# EAGLE design Modulator and Front End (EAGLE 6.3)

## Sheet 1 of 4
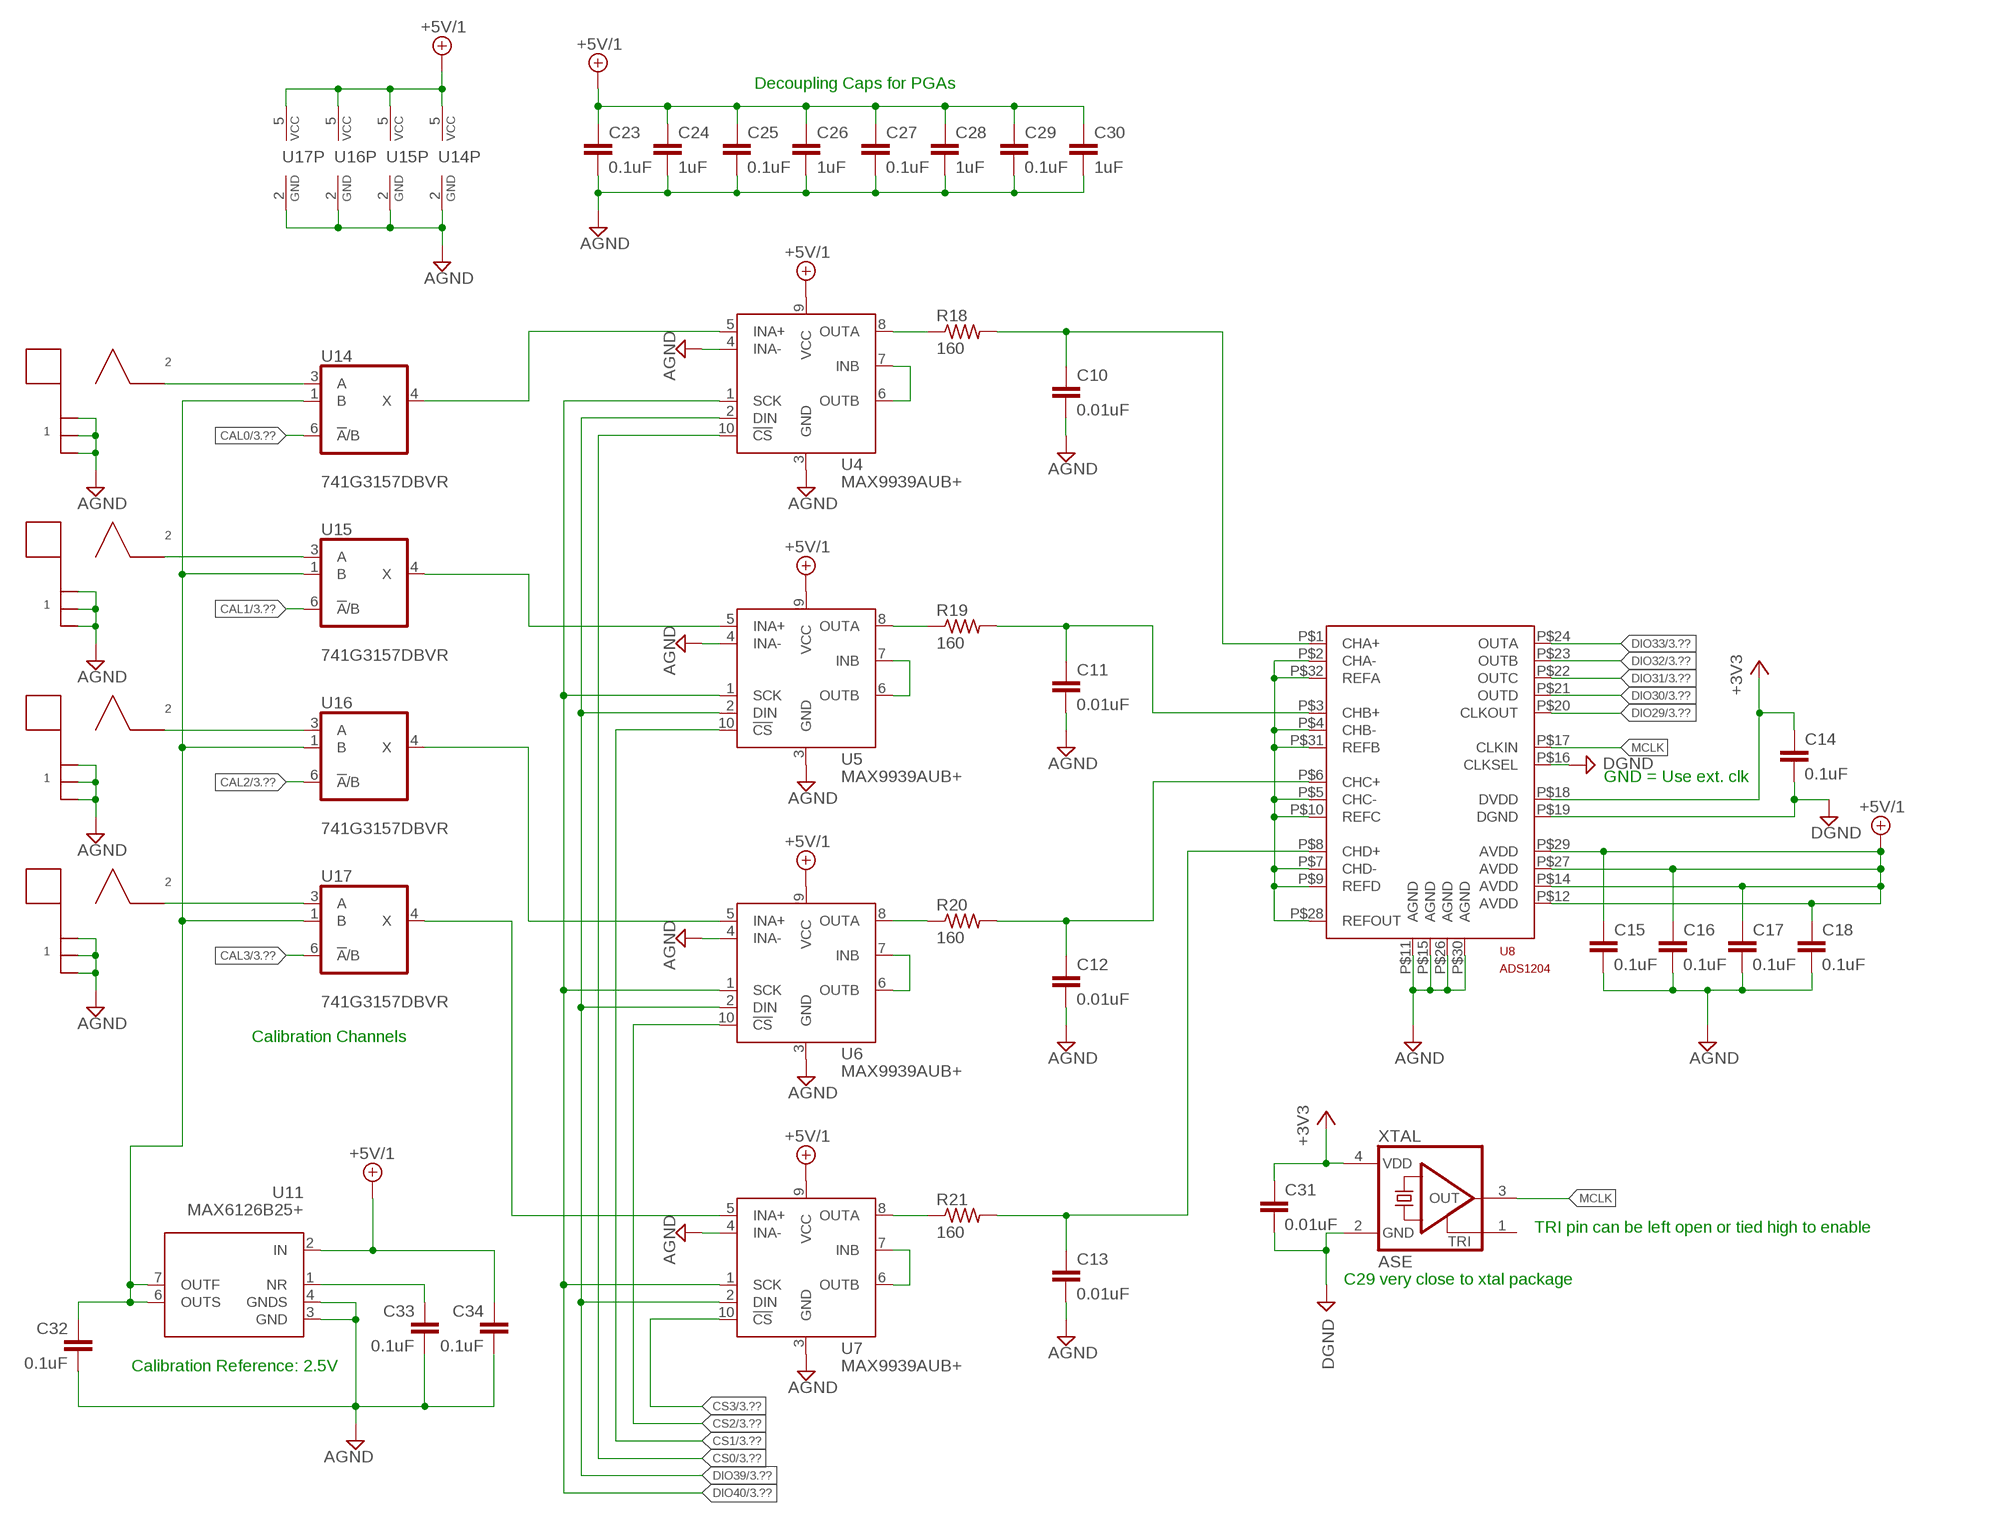
[diagram p0: schematic, sheet 1]

### Parts
C10  0.01uF  C-EUC0805  [C0805]
C11  0.01uF  C-EUC0805  [C0805]
C12  0.01uF  C-EUC0805  [C0805]
C13  0.01uF  C-EUC0805  [C0805]
C14  0.1uF  C-EUC0805  [C0805]
C15  0.1uF  C-EUC0805  [C0805]
C16  0.1uF  C-EUC0805  [C0805]
C17  0.1uF  C-EUC0805  [C0805]
C18  0.1uF  C-EUC0805  [C0805]
C23  0.1uF  C-EUC0805  [C0805]
C24  1uF  C-EUC0805  [C0805]
C25  0.1uF  C-EUC0805  [C0805]
C26  1uF  C-EUC0805  [C0805]
C27  0.1uF  C-EUC0805  [C0805]
C28  1uF  C-EUC0805  [C0805]
C29  0.1uF  C-EUC0805  [C0805]
C30  1uF  C-EUC0805  [C0805]
C31  0.01uF  C-EUC0805  [C0805]
C32  0.1uF  C-EUC0805  [C0805]
C33  0.1uF  C-EUC0805  [C0805]
C34  0.1uF  C-EUC0805  [C0805]
INA  RCJ-01X  [RCJ-01X]
INB  RCJ-01X  [RCJ-01X]
INC  RCJ-01X  [RCJ-01X]
IND  RCJ-01X  [RCJ-01X]
R18  160  R-US_M0805  [M0805]
R19  160  R-US_M0805  [M0805]
R20  160  R-US_M0805  [M0805]
R21  160  R-US_M0805  [M0805]
U4  MAX9939AUB+  [UMAX10]
U5  MAX9939AUB+  [UMAX10]
U6  MAX9939AUB+  [UMAX10]
U7  MAX9939AUB+  [UMAX10]
U8  ADS1204  [QFN-32]
U11  MAX6126B25+  [UMAX8]
U14  741G3157DBVR  [DBV_R-PDSO-G6]
U15  741G3157DBVR  [DBV_R-PDSO-G6]
U16  741G3157DBVR  [DBV_R-PDSO-G6]
U17  741G3157DBVR  [DBV_R-PDSO-G6]
XTAL  ASE  [ASE]

### Nets
+3V3: C14.1 C31.1 U8.P$18(DVDD) XTAL.4(VDD) ; also sheet 2,3
+5V/1: C15.1 C16.1 C17.1 C18.1 C23.1 C24.1 C25.1 C26.1 C27.1 C28.1 C29.1 C30.1 C34.1 U4.9(VCC) U5.9(VCC) U6.9(VCC) U7.9(VCC) U8.P$12(AVDD) U8.P$14(AVDD) U8.P$27(AVDD) U8.P$29(AVDD) U11.2(IN) U14.5(VCC) U15.5(VCC) U16.5(VCC) U17.5(VCC) ; also sheet 2,4
AGND: C10.2 C11.2 C12.2 C13.2 C15.2 C16.2 C17.2 C18.2 C23.2 C24.2 C25.2 C26.2 C27.2 C28.2 C29.2 C30.2 C32.2 C33.2 C34.2 INA.1@1 INA.1@2 INA.1@3 INB.1@1 INB.1@2 INB.1@3 INC.1@1 INC.1@2 INC.1@3 IND.1@1 IND.1@2 IND.1@3 U4.3(GND) U4.4(INA-) U5.3(GND) U5.4(INA-) U6.3(GND) U6.4(INA-) U7.3(GND) U7.4(INA-) U8.P$11(AGND) U8.P$15(AGND) U8.P$26(AGND) U8.P$30(AGND) U11.3(GND) U11.4(GNDS) U14.2(GND) U15.2(GND) U16.2(GND) U17.2(GND) ; also sheet 2,4
CAL0: U14.6(!A!/B) ; also sheet 3
CAL1: U15.6(!A!/B) ; also sheet 3
CAL2: U16.6(!A!/B) ; also sheet 3
CAL3: U17.6(!A!/B) ; also sheet 3
CS0: U4.10(!CS) ; also sheet 3
CS1: U5.10(!CS) ; also sheet 3
CS2: U6.10(!CS) ; also sheet 3
CS3: U7.10(!CS) ; also sheet 3
DGND: C14.2 C31.2 U8.P$16(CLKSEL) U8.P$19(DGND) XTAL.2(GND) ; also sheet 2,3
DIO29: U8.P$20(CLKOUT) ; also sheet 3
DIO30: U8.P$21(OUTD) ; also sheet 3
DIO31: U8.P$22(OUTC) ; also sheet 3
DIO32: U8.P$23(OUTB) ; also sheet 3
DIO33: U8.P$24(OUTA) ; also sheet 3
DIO39: U4.2(DIN) U5.2(DIN) U6.2(DIN) U7.2(DIN) ; also sheet 3
DIO40: U4.1(SCK) U5.1(SCK) U6.1(SCK) U7.1(SCK) ; also sheet 3
MCLK: U8.P$17(CLKIN) XTAL.3(OUT)
N$1: R21.1 U7.8(OUTA)
N$3: R20.1 U6.8(OUTA)
N$4: C10.1 R18.2 U8.P$1(CHA+)
N$6: R19.1 U5.8(OUTA)
N$10: R18.1 U4.8(OUTA)
N$12: C33.1 U11.1(NR)
N$14: C11.1 R19.2 U8.P$3(CHB+)
N$15: U4.5(INA+) U14.4(X)
N$17: U5.5(INA+) U15.4(X)
N$18: U6.5(INA+) U16.4(X)
N$19: INA.2 U14.3(A)
N$20: C12.1 R20.2 U8.P$6(CHC+)
N$21: C13.1 R21.2 U8.P$8(CHD+)
N$22: INB.2 U15.3(A)
N$23: INC.2 U16.3(A)
N$24: IND.2 U17.3(A)
N$25: U7.5(INA+) U17.4(X)
N$27: C32.1 U11.6(OUTS) U11.7(OUTF) U14.1(B) U15.1(B) U16.1(B) U17.1(B)
N$50: U4.6(OUTB) U4.7(INB)
N$51: U5.6(OUTB) U5.7(INB)
N$52: U6.6(OUTB) U6.7(INB)
N$53: U7.6(OUTB) U7.7(INB)
VREF: U8.P$2(CHA-) U8.P$4(CHB-) U8.P$5(CHC-) U8.P$7(CHD-) U8.P$9(REFD) U8.P$10(REFC) U8.P$28(REFOUT) U8.P$31(REFB) U8.P$32(REFA)
Unconnected: XTAL.1(TRI)

### Notes on the sheet
- Decoupling Caps for PGAs
- GND = Use ext. clk
- Calibration Channels
- TRI pin can be left open or tied high to enable
- C29 very close to xtal package
- Calibration Reference: 2.5V

## Sheet 2 of 4
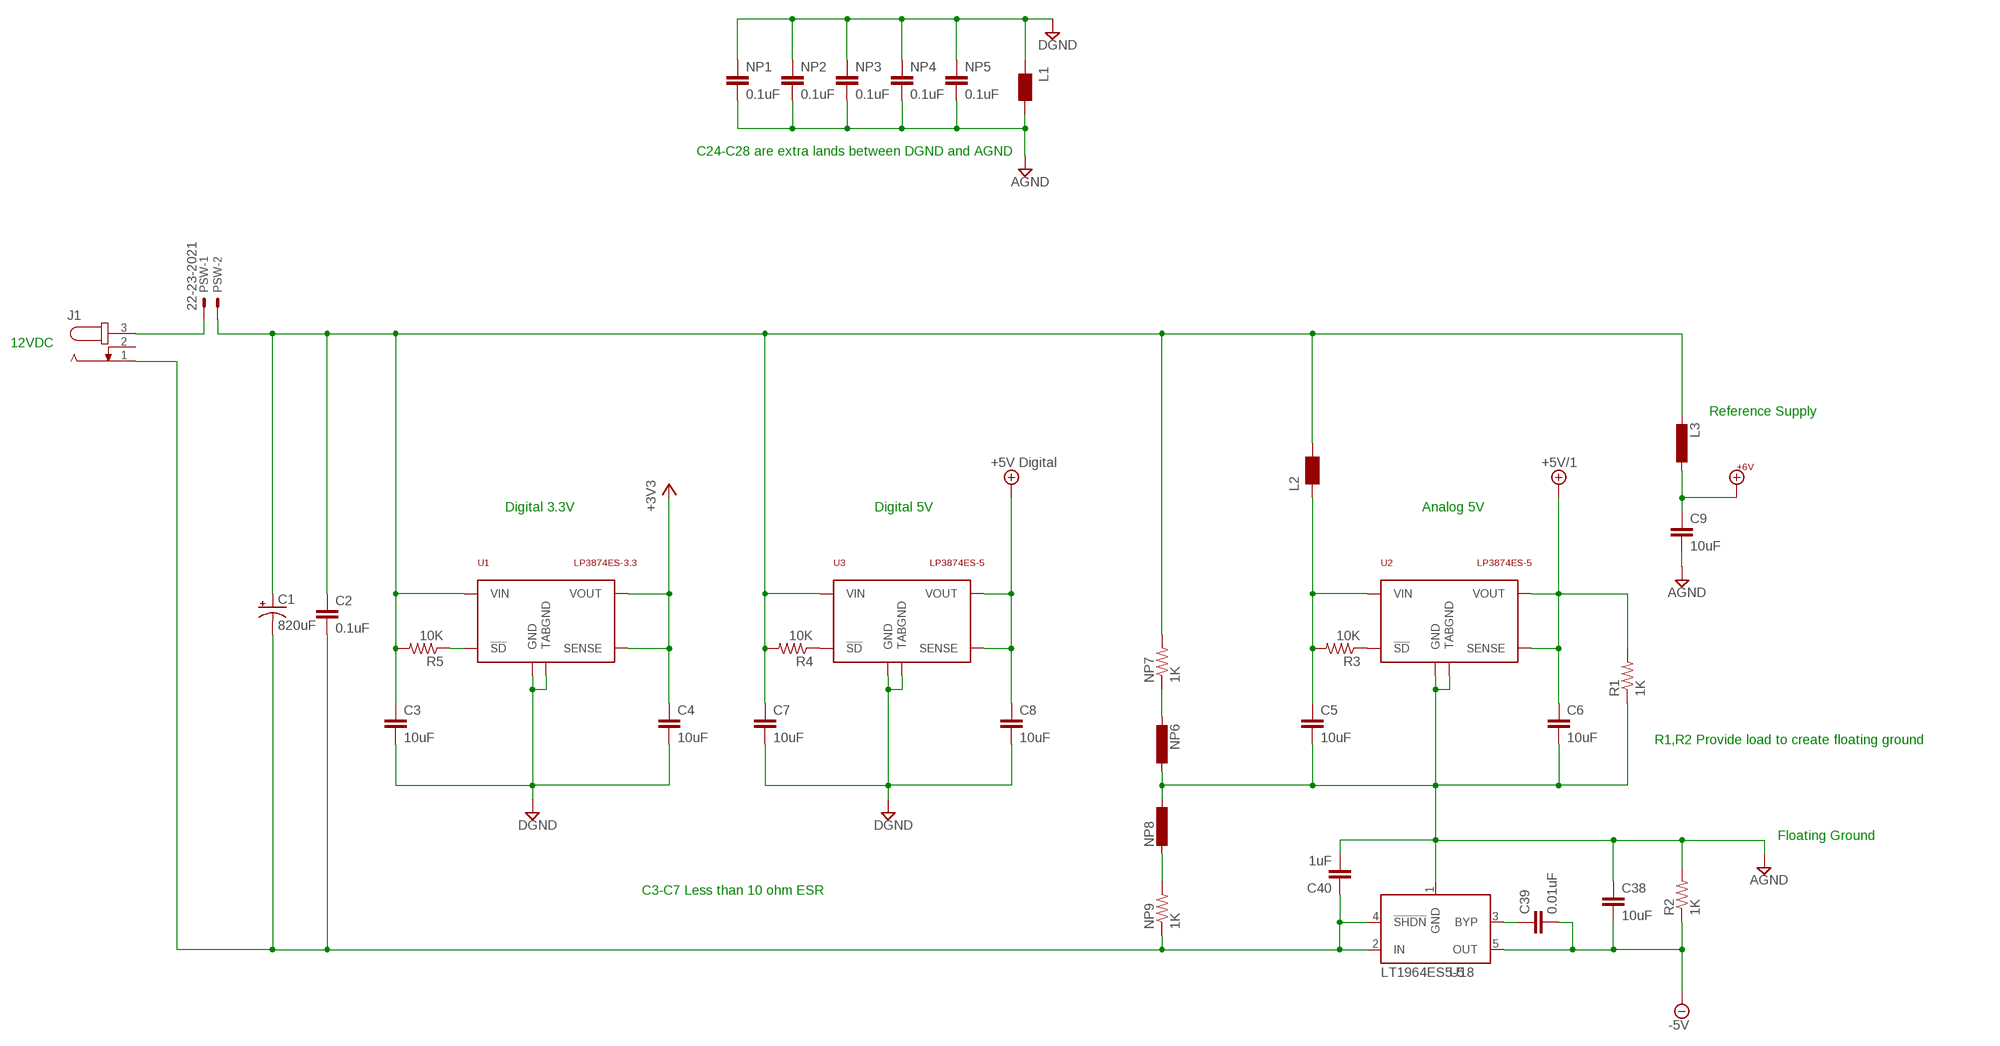
[diagram p1: schematic, sheet 2]

### Parts
C1  820uF  CPOL-USE5-13  [E5-13]
C2  0.1uF  C-EUC0805  [C0805]
C3  10uF  C-EUC1206  [C1206]
C4  10uF  C-EUC1206  [C1206]
C5  10uF  C-EUC1206  [C1206]
C6  10uF  C-EUC1206  [C1206]
C7  10uF  C-EUC1206  [C1206]
C8  10uF  C-EUC1206  [C1206]
C9  10uF  C-EUC1206  [C1206]
C38  10uF  C-EUC1206  [C1206]
C39  0.01uF  C-EUC1206  [C1206]
C40  1uF  C-EUC1206  [C1206]
J1  JACK-PLUG1  [SPC4078]
L1  WE-CBF_0603  [0603]
L2  WE-CBF_0603  [0603]
L3  L-EUL1812  [L1812]
NP1  0.1uF  C-EUC0805  [C0805]
NP2  0.1uF  C-EUC0805  [C0805]
NP3  0.1uF  C-EUC0805  [C0805]
NP4  0.1uF  C-EUC0805  [C0805]
NP5  0.1uF  C-EUC0805  [C0805]
NP6  L-EUL1812  [L1812]
NP7  1K  R-US_M0805  [M0805]
NP8  L-EUL1812  [L1812]
NP9  1K  R-US_M0805  [M0805]
PSW  22-23-2021  [22-23-2021]
R1  1K  R-US_M0805  [M0805]
R2  1K  R-US_M0805  [M0805]
R3  10K  R-US_M0805  [M0805]
R4  10K  R-US_M0805  [M0805]
R5  10K  R-US_M0805  [M0805]
U1  LP3874ES-3.3  [TO263-5]
U2  LP3874ES-5  [TO263-5]
U3  LP3874ES-5  [TO263-5]
U18  LT1964ES5-5  [SOT23-5]

### Nets
+3V3: C4.1 U1.4(VOUT) U1.5(SENSE) ; also sheet 1,3
+5V/1: C6.1 R1.2 U2.4(VOUT) U2.5(SENSE) ; also sheet 1,4
+5V/2: C8.1 U3.4(VOUT) U3.5(SENSE) ; supply symbol labelled +5V Digital ; also sheet 3
+6V: C9.1 L3.1 ; also sheet 4
-5V: C38.2 C39.2 R2.1 U18.5(OUT) ; also sheet 4
AGND: C5.2 C6.2 C9.2 C38.1 C40.2 L1.2 NP1.2 NP2.2 NP3.2 NP4.2 NP5.2 NP6.1 NP8.1 R1.1 R2.2 U2.3(GND) U2.6(TABGND) U18.1(GND) ; also sheet 1,4
DGND: C3.2 C4.2 C7.2 C8.2 L1.1 NP1.1 NP2.1 NP3.1 NP4.1 NP5.1 U1.3(GND) U1.6(TABGND) U3.3(GND) U3.6(TABGND) ; also sheet 1,3
N$5: C1.- C2.2 C40.1 J1.1 NP9.1 U18.2(IN) U18.4(!SHDN)
N$7: R3.1 U2.1(!SD)
N$8: C5.1 L2.1 R3.2 U2.2(VIN)
N$9: NP8.2 NP9.2
N$13: C39.1 U18.3(BYP)
N$31: R4.1 U3.1(!SD)
N$48: NP6.2 NP7.1
N$49: J1.3 PSW.1
N$911: R5.1 U1.1(!SD)
PWRIN: C1.+ C2.1 C3.1 C7.1 L2.2 L3.2 NP7.2 PSW.2 R4.2 R5.2 U1.2(VIN) U3.2(VIN)
Unconnected: J1.2

### Notes on the sheet
- C24-C28 are extra lands between DGND and AGND
- 12VDC
- Reference Supply
- Digital 3.3V | Digital 5V | Analog 5V
- R1,R2 Provide load to create floating ground
- Floating Ground
- C3-C7 Less than 10 ohm ESR

## Sheet 3 of 4
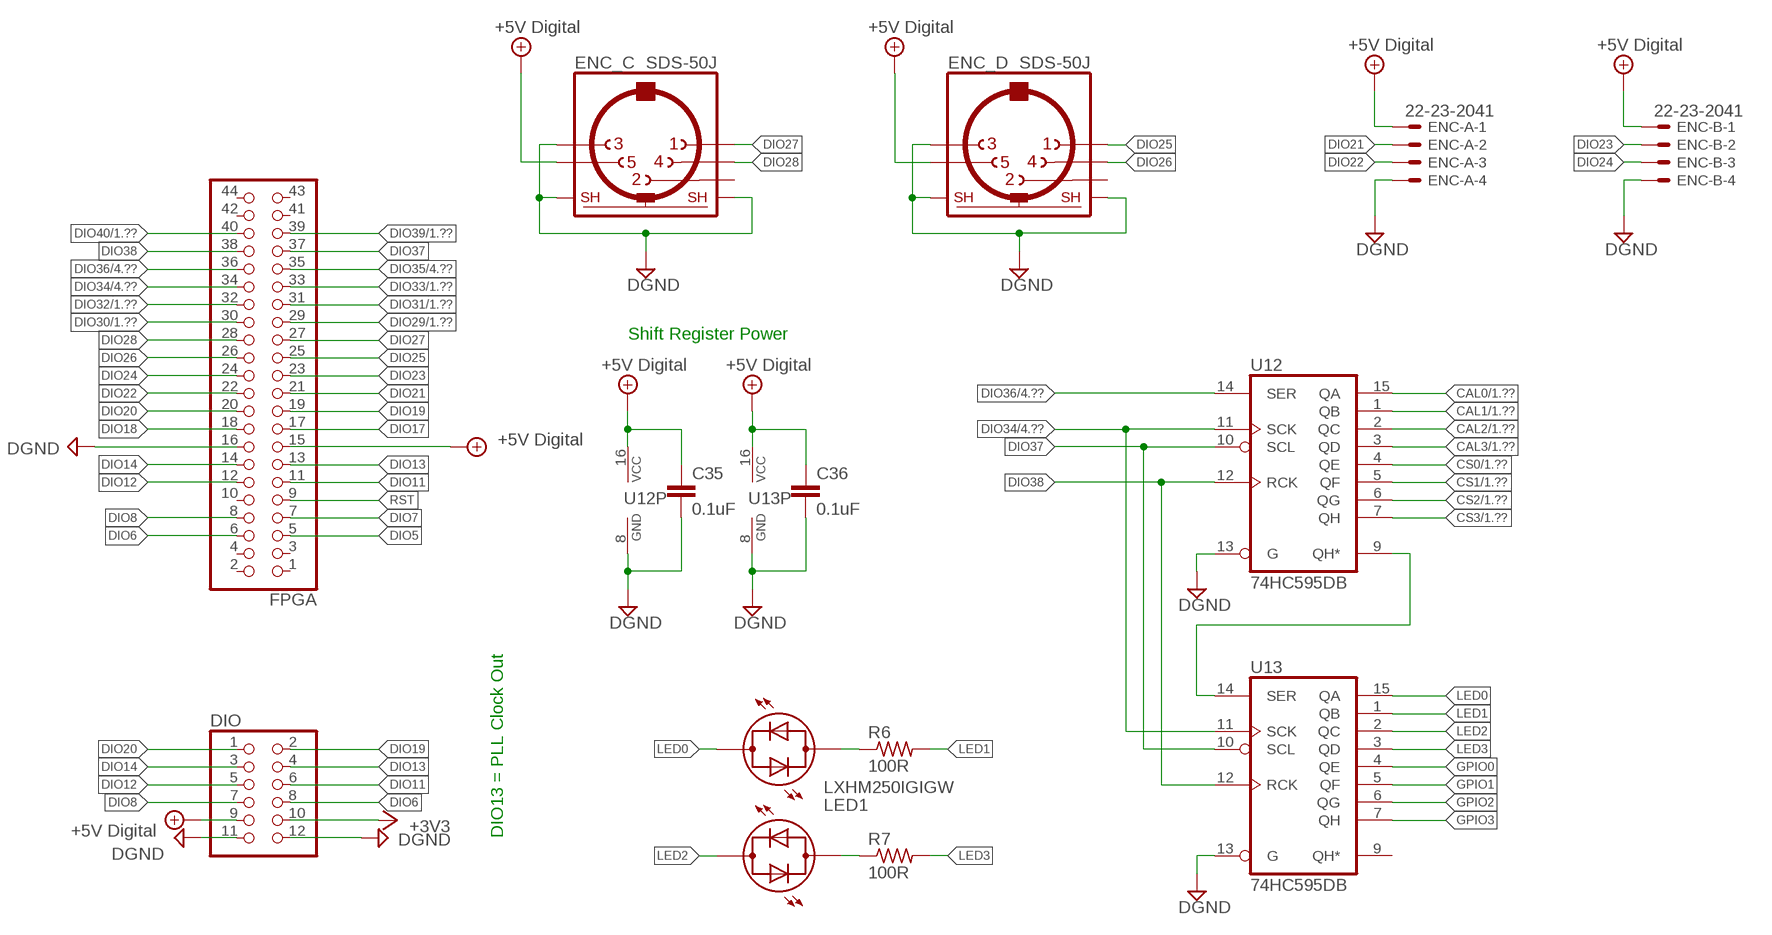
[diagram p2: schematic, sheet 3]

### Parts
C35  0.1uF  C-EUC0805  [C0805]
C36  0.1uF  C-EUC0805  [C0805]
DIO  PINHD-2X6  [2X06]
ENC-A  22-23-2041  [22-23-2041]
ENC-B  22-23-2041  [22-23-2041]
ENC_C  SDS-50J  [SDS-50J]
ENC_D  SDS-50J  [SDS-50J]
FPGA  PINHD-2X22  [2X22]
LED1  LXHM250IGIGW  [LXHM250IGIGW]
R6  100R  R-US_R0805  [R0805]
R7  100R  R-US_R0805  [R0805]
U12  74HC595DB  [SSOP16]
U13  74HC595DB  [SSOP16]

### Nets
+3V3: DIO.10 ; also sheet 1,2
+5V/2: C35.1 C36.1 DIO.9 ENC-A.1 ENC-B.1 ENC_C.5 ENC_D.5 FPGA.15 U12.16(VCC) U13.16(VCC) ; supply symbol labelled +5V Digital ; also sheet 2
CAL0: U12.15(QA) ; also sheet 1
CAL1: U12.1(QB) ; also sheet 1
CAL2: U12.2(QC) ; also sheet 1
CAL3: U12.3(QD) ; also sheet 1
CS0: U12.4(QE) ; also sheet 1
CS1: U12.5(QF) ; also sheet 1
CS2: U12.6(QG) ; also sheet 1
CS3: U12.7(QH) ; also sheet 1
DGND: C35.2 C36.2 DIO.11 DIO.12 ENC-A.4 ENC-B.4 ENC_C.3 ENC_C.SH1 ENC_C.SH2 ENC_D.3 ENC_D.SH1 ENC_D.SH2 FPGA.16 U12.8(GND) U12.13(G) U13.8(GND) U13.13(G) ; also sheet 1,2
DIO5: FPGA.5
DIO6: DIO.8 FPGA.6
DIO7: FPGA.7
DIO8: DIO.7 FPGA.8
DIO11: DIO.6 FPGA.11
DIO12: DIO.5 FPGA.12
DIO13: DIO.4 FPGA.13
DIO14: DIO.3 FPGA.14
DIO17: FPGA.17
DIO18: FPGA.18
DIO19: DIO.2 FPGA.19
DIO20: DIO.1 FPGA.20
DIO21: ENC-A.2 FPGA.21
DIO22: ENC-A.3 FPGA.22
DIO23: ENC-B.2 FPGA.23
DIO24: ENC-B.3 FPGA.24
DIO25: ENC_D.1 FPGA.25
DIO26: ENC_D.4 FPGA.26
DIO27: ENC_C.1 FPGA.27
DIO28: ENC_C.4 FPGA.28
DIO29: FPGA.29 ; also sheet 1
DIO30: FPGA.30 ; also sheet 1
DIO31: FPGA.31 ; also sheet 1
DIO32: FPGA.32 ; also sheet 1
DIO33: FPGA.33 ; also sheet 1
DIO34: FPGA.34 U12.11(SCK) U13.11(SCK) ; also sheet 4
DIO35: FPGA.35 ; also sheet 4
DIO36: FPGA.36 U12.14(SER) ; also sheet 4
DIO37: FPGA.37 U12.10(SCL) U13.10(SCL)
DIO38: FPGA.38 U12.12(RCK) U13.12(RCK)
DIO39: FPGA.39 ; also sheet 1
DIO40: FPGA.40 ; also sheet 1
GPIO0: U13.4(QE)
GPIO1: U13.5(QF)
GPIO2: U13.6(QG)
GPIO3: U13.7(QH)
LED0: LED1.AR1 U13.15(QA)
LED1: R6.2 U13.1(QB)
LED2: LED1.AR2 U13.2(QC)
LED3: R7.2 U13.3(QD)
N$2: U12.9(QH*) U13.14(SER)
N$28: LED1.AG1 R6.1
N$38: LED1.AG2 R7.1
RST: FPGA.9
Unconnected: ENC_C.2 ENC_D.2 FPGA.1 FPGA.2 FPGA.3 FPGA.4 FPGA.10 FPGA.41 FPGA.42 FPGA.43 FPGA.44 U13.9(QH*)

### Notes on the sheet
- Shift Register Power
- DIO13 = PLL Clock Out

## Sheet 4 of 4
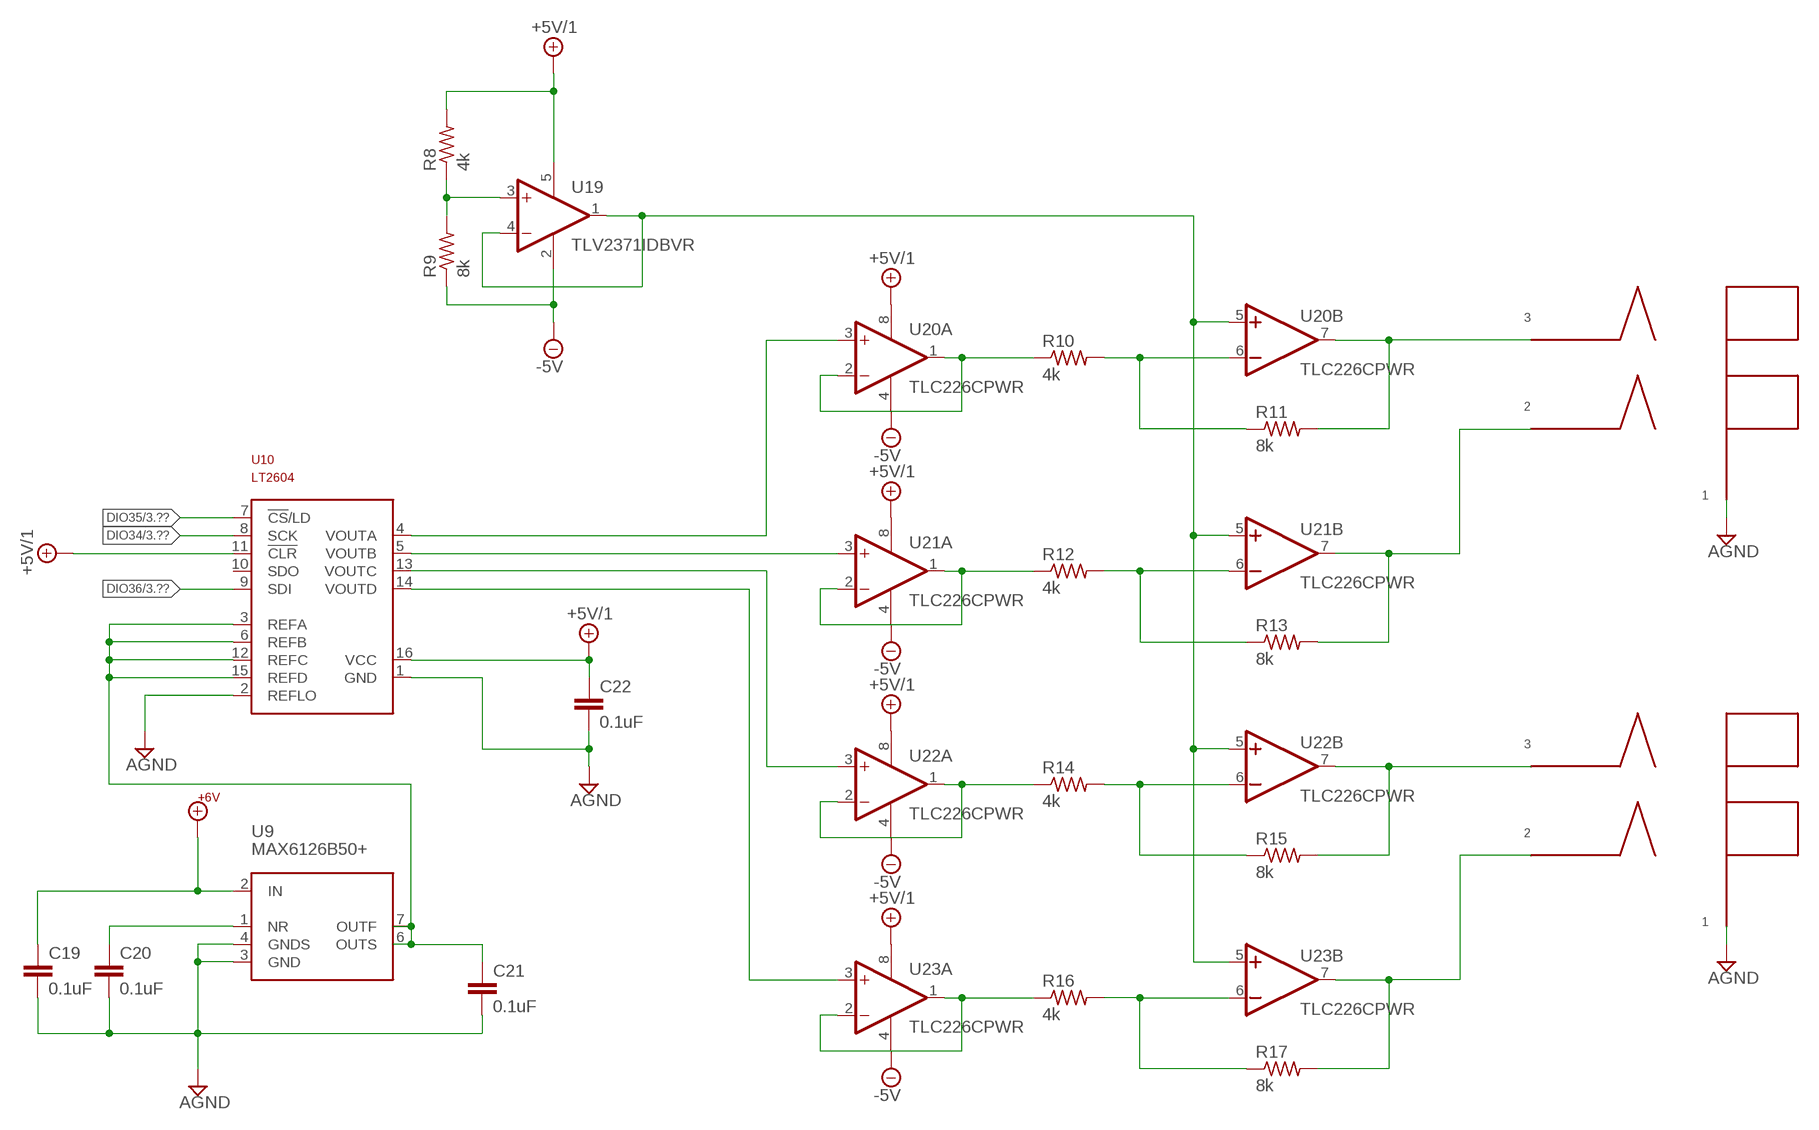
[diagram p3: schematic, sheet 4]

### Parts
C19  0.1uF  C-EUC0805  [C0805]
C20  0.1uF  C-EUC0805  [C0805]
C21  0.1uF  C-EUC0805  [C0805]
C22  0.1uF  C-EUC0805  [C0805]
OUTAB  RCJ-22XX  [RCJ-22XX]
OUTCD  RCJ-22XX  [RCJ-22XX]
R8  4k  R-US_R0805  [R0805]
R9  8k  R-US_R0805  [R0805]
R10  4k  R-US_R0805  [R0805]
R11  8k  R-US_R0805  [R0805]
R12  4k  R-US_R0805  [R0805]
R13  8k  R-US_R0805  [R0805]
R14  4k  R-US_R0805  [R0805]
R15  8k  R-US_R0805  [R0805]
R16  4k  R-US_R0805  [R0805]
R17  8k  R-US_R0805  [R0805]
U9  MAX6126B50+  [UMAX8]
U10  LT2604  [SSOP16]
U19  TLV2371IDBVR  [SOT23-DBV]
U20  TLC226CPWR  [TSSOP8]
U21  TLC226CPWR  [TSSOP8]
U22  TLC226CPWR  [TSSOP8]
U23  TLC226CPWR  [TSSOP8]

### Nets
+5V/1: C22.1 R8.2 U10.11(!CLR) U10.16(VCC) U19.5(V+) U20.8(A:V+) U21.8(A:V+) U22.8(A:V+) U23.8(A:V+) ; also sheet 1,2
+6V: C19.1 U9.2(IN) ; also sheet 2
-5V: R9.1 U19.2(V-) U20.4(A:V-) U21.4(A:V-) U22.4(A:V-) U23.4(A:V-) ; also sheet 2
AGND: C19.2 C20.2 C21.2 C22.2 OUTAB.1 OUTCD.1 U9.3(GND) U9.4(GNDS) U10.1(GND) U10.2(REFLO) ; also sheet 1,2
DIO34: U10.8(SCK) ; also sheet 3
DIO35: U10.7(!CS!/LD) ; also sheet 3
DIO36: U10.9(SDI) ; also sheet 3
N$11: R8.1 R9.2 U19.3(+IN)
N$16: U19.1(OUT) U19.4(-IN) U20.5(B:+IN) U21.5(B:+IN) U22.5(B:+IN) U23.5(B:+IN)
N$26: C20.1 U9.1(NR)
N$29: R10.1 U20.1(A:OUT) U20.2(A:-IN)
N$30: C21.1 U9.6(OUTS) U9.7(OUTF) U10.3(REFA) U10.6(REFB) U10.12(REFC) U10.15(REFD)
N$32: U10.4(VOUTA) U20.3(A:+IN)
N$33: U10.5(VOUTB) U21.3(A:+IN)
N$34: U10.13(VOUTC) U22.3(A:+IN)
N$35: U10.14(VOUTD) U23.3(A:+IN)
N$36: R10.2 R11.1 U20.6(B:-IN)
N$37: OUTAB.3 R11.2 U20.7(B:OUT)
N$39: OUTAB.2 R13.2 U21.7(B:OUT)
N$40: R12.2 R13.1 U21.6(B:-IN)
N$41: R14.2 R15.1 U22.6(B:-IN)
N$42: OUTCD.3 R15.2 U22.7(B:OUT)
N$43: OUTCD.2 R17.2 U23.7(B:OUT)
N$44: R16.2 R17.1 U23.6(B:-IN)
N$45: R12.1 U21.1(A:OUT) U21.2(A:-IN)
N$46: R14.1 U22.1(A:OUT) U22.2(A:-IN)
N$47: R16.1 U23.1(A:OUT) U23.2(A:-IN)
Unconnected: U10.10(SDO)

## Library data of the parts
C1 = rcl:CPOL-US: POLARIZED CAPACITOR, American symbol; PARTNO: EEU-TP1E821
C2 C14-C23 C25 C27 C29 C32-C36 = rcl:C-EU: CAPACITOR, European symbol; PARTNO: LMK212SD104KG-T
C3-C9 C38 = rcl:C-EU: CAPACITOR, European symbol; PARTNO: F951C106MPAAQ2
C10-C13 C31 C39 = rcl:C-EU: CAPACITOR, European symbol; PARTNO: 0805YA103JAT2A
C24 C26 C28 C30 C40 = rcl:C-EU: CAPACITOR, European symbol; PARTNO: C2012X7R1A105K
DIO = pinhead:PINHD-2X6: PIN HEADER; PARTNO: 68602-112HLF
ENC-A ENC-B = con-molex:22-23-2041: .100" (2.54mm) Center Header - 4 Pin; MF: MOLEX; MPN: 22-23-2041; OC_FARNELL: 1462920; OC_NEWARK: 38C0355; PARTNO: 22-23-2041
ENC_C ENC_D = con-cui:SDS-50J; PARTNO: SDS-50J
FPGA = pinhead:PINHD-2X22: PIN HEADER; PARTNO: *
INA = con-cui:RCJ-01X; PARTNO: RCJ-012
INB = con-cui:RCJ-01X; PARTNO: RCJ-011
INC = con-cui:RCJ-01X; PARTNO: RCJ-013
IND = con-cui:RCJ-01X; PARTNO: RCJ-014
J1 = con-jack:JACK-PLUG: DC POWER JACK Power Jack, DC, Right Angle, Through Hole, Rated 5A at 16VDC, PC Terminals Distributor: Farnell (www.Farnell.de) Drawing: 84N1161.pdf / 84N1162.pdf Manufacturer: SPC Technology (www.spctechnology.com) Type: SPC4077 / SPC 4078; OC_FARNELL: unknown; OC_NEWARK: unknown; PARTNO: PJ-102B
L1 L2 = wuerth-elektronik:WE-CBF: SMD EMI Suppression Ferrite Beads - excellent anti-EMI properties - low DCR - impedances till 3000 ohms - rated current up to 6 A; PARTNO: MPZ1608S101A
L3 = rcl:L-EU: INDUCTOR, European symbol; PARTNO: NLC453232T-100K-PF
LED1 = led:LXHM250IGIGW; PARTNO: SSF-LXHM250IGIGW
NP1-NP5 = rcl:C-EU: CAPACITOR, European symbol; PARTNO: *
NP6 NP8 = rcl:L-EU: INDUCTOR, European symbol; PARTNO: *
NP7 NP9 = rcl:R-US_: RESISTOR, American symbol; PARTNO: *
OUTAB = con-cui:RCJ-22XX; PARTNO: RCJ-2221
OUTCD = con-cui:RCJ-22XX; PARTNO: RCJ-2234
PSW = con-molex:22-23-2021: .100" (2.54mm) Center Header - 2 Pin; MF: MOLEX; MPN: 22-23-2021; OC_FARNELL: 1462926; OC_NEWARK: 25C3832; PARTNO: 22-23-2021
R1 R2 = rcl:R-US_: RESISTOR, American symbol; PARTNO: ERJ-6GEYJ102V
R3-R5 = rcl:R-US_: RESISTOR, American symbol; PARTNO: ERJ-6GEYJ103V
R6 R7 = rcl:R-US_: RESISTOR, American symbol; PARTNO: ERJ-6GEYJ101V
R8 R10 R12 R14 R16 = rcl:R-US_: RESISTOR, American symbol; PARTNO: ERJ-6ENF5101V
R9 R11 R13 R15 R17 = rcl:R-US_: RESISTOR, American symbol; PARTNO: ERJ-6ENF1022V
R18-R21 = rcl:R-US_: RESISTOR, American symbol; PARTNO: ERJ-6ENF1600V
U1 = national-semiconductor:LP3874; PARTNO: LP3872ES-3.3/NOPB
U2 U3 = national-semiconductor:LP3874; PARTNO: LP3872ES-5.0/NOPB
U4-U7 = maxim:MAX9939: SPI Programmable-Gain Amplifier with Input Vos Trim and Output Op Amp The MAX9939 is a SPI programmable single PGA amplifier. Gains range from 0.25V/V to 157V/V and it contains an input offset trimming register and offset test capability. It also includes a separate op amp with accessible inverting input and output for an external filter or for adding differential output. The non-inverting input of the secondary op amp is tied to Vcc/2.; PARTNO: MAX9939AUB+
U8 = texas:ADS1204: Four 1-Bit, 10MHz, 2nd-Order DELTA-SIGMA MODULATORS Source: http://focus.ti.com/docs/prod/folders/print/ads1204.html; PARTNO: ADS1204IRHBT
U9 = maxim:MAX6126: Ultra-High-Precision, Ultra-Low-Noise, Series Voltage Reference; PARTNO: MAX6126B50+
U10 = linear-technology:LT2604; PARTNO: LTC2604CGN#PBF
U11 = maxim:MAX6126: Ultra-High-Precision, Ultra-Low-Noise, Series Voltage Reference; PARTNO: MAX6126B25+
U12 U13 = 74xx-eu:74*595: 8-bit SHIFT REGISTER, output latch; PARTNO: "74HC595DB,112"
U14-U17 = 74xx-little-us:74*1G3157: Single-Pole, Double-Throw Analog Switch Source: http://focus.ti.com/lit/ds/symlink/sn74lvc1g3157.pdf; PARTNO: "74LVC1G3157GW,125"
U18 = linear-technology:LT1964; PARTNO: LT1964ES5-5#TRMPBF
U19 = texas:TLV237*; PARTNO: TLV2371IDBVR
U20-U23 = texas:TLC226*; PARTNO: TLC2262CPWR
XTAL = crystal:ASE: 3.3Vdc CMOS SMD CRYSTAL CLOCK OSCILLATOR SOurce: www.abracon.com; OC_FARNELL: unknown; OC_NEWARK: unknown; PARTNO: CB3LV-3C-20M4800

## Board
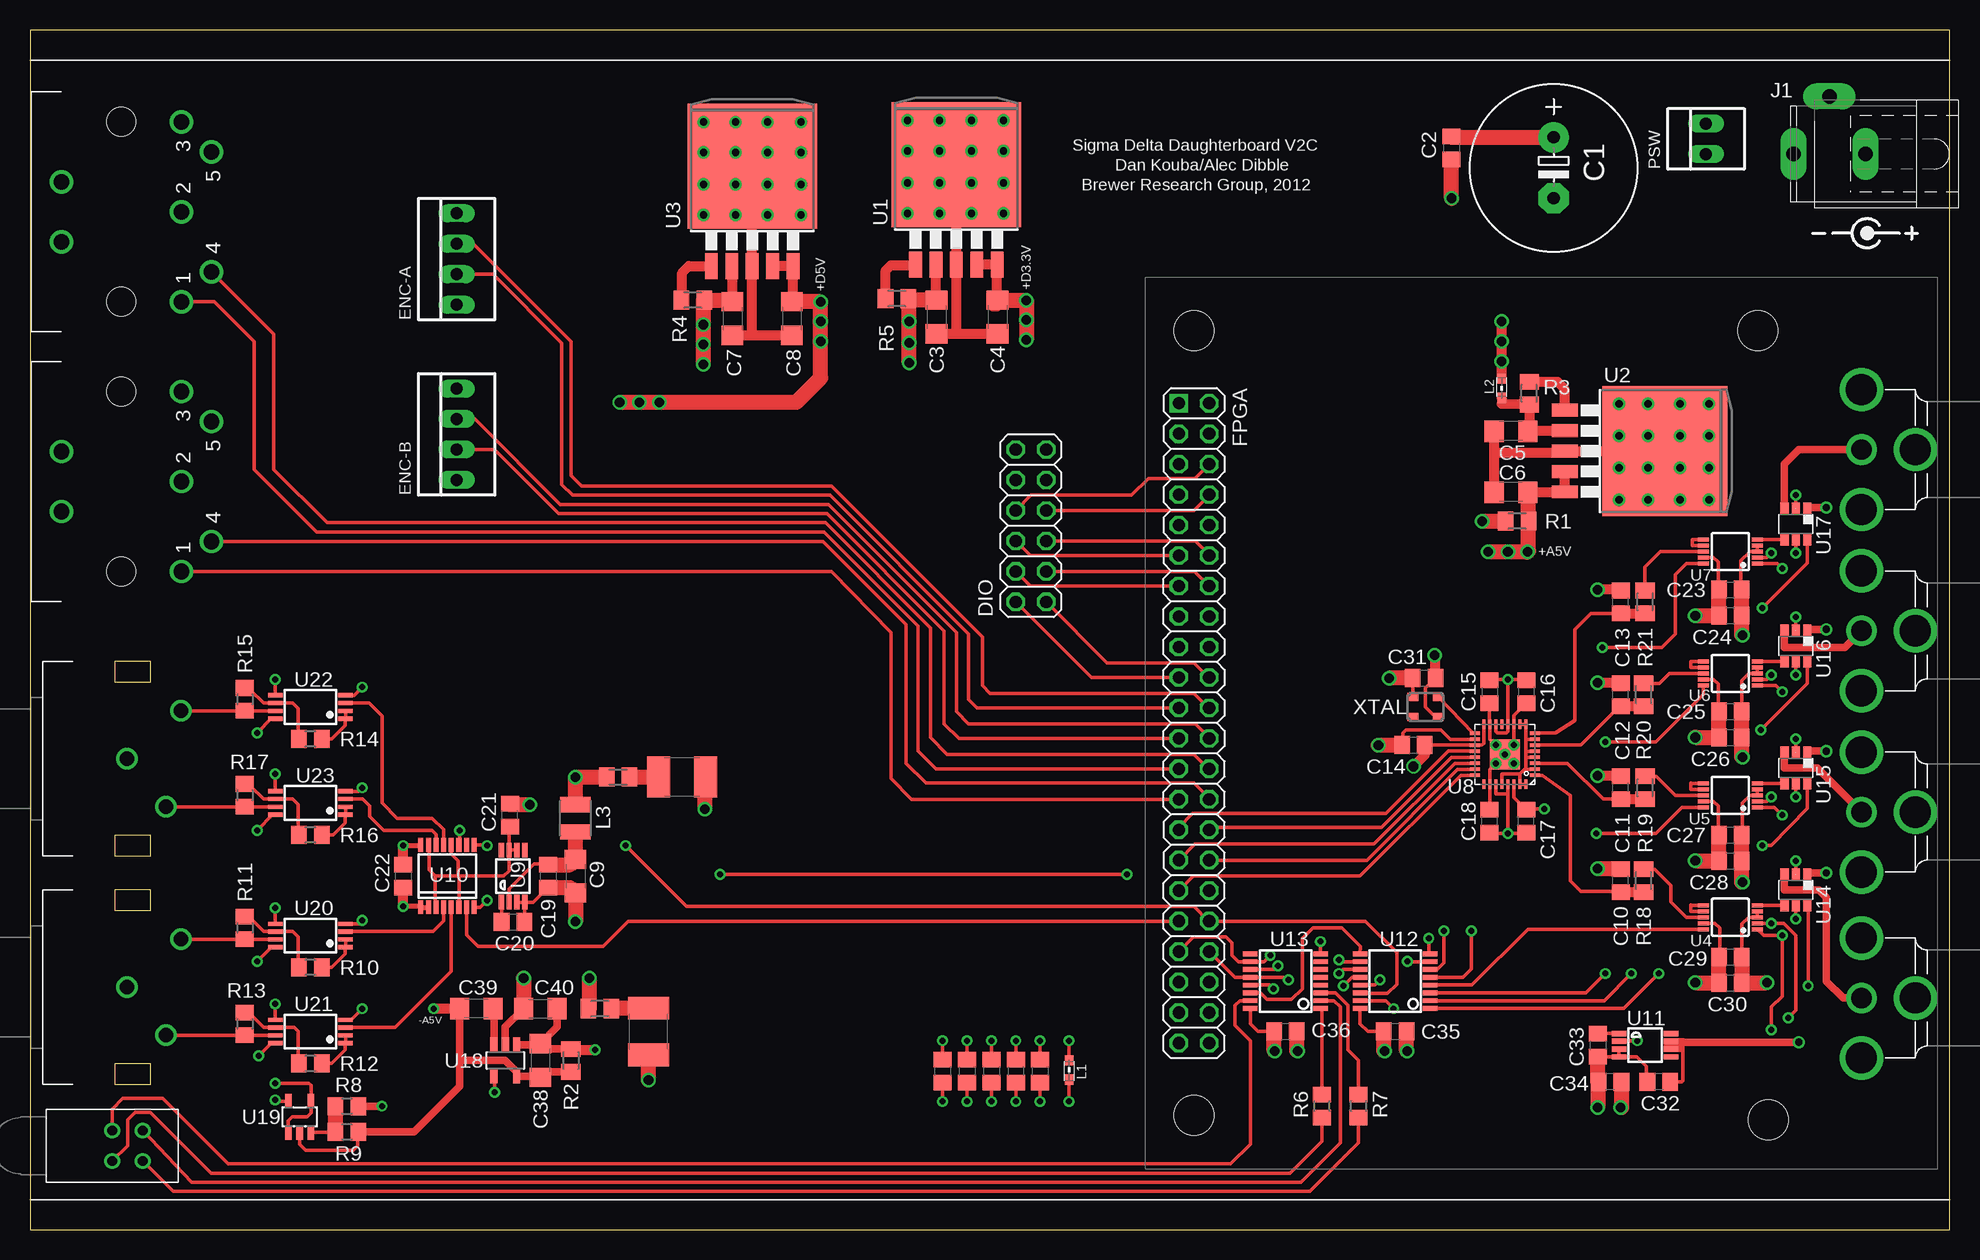
[diagram p4: board, top side]
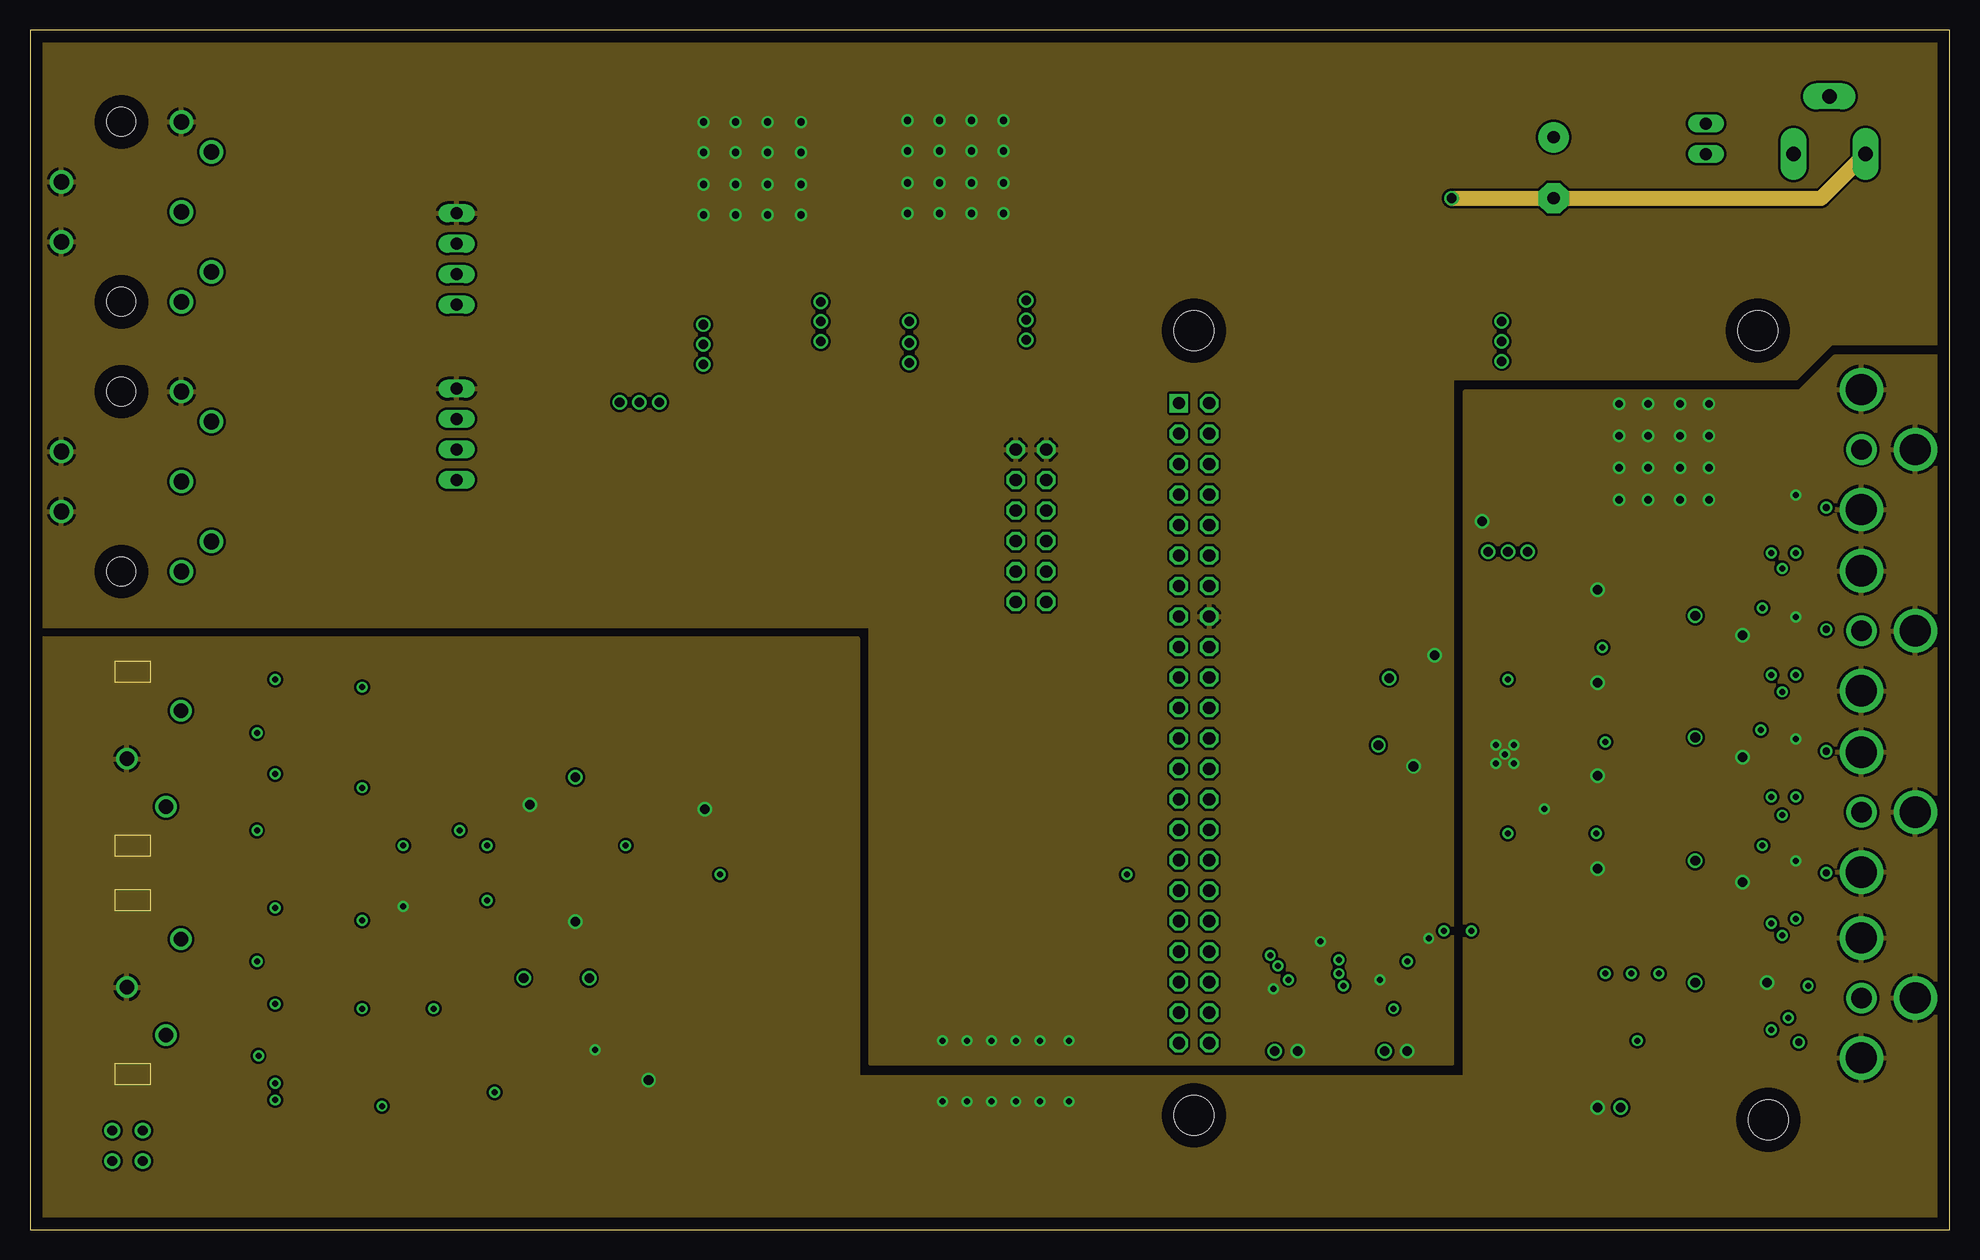
[diagram p5: board, inner layer Route2]
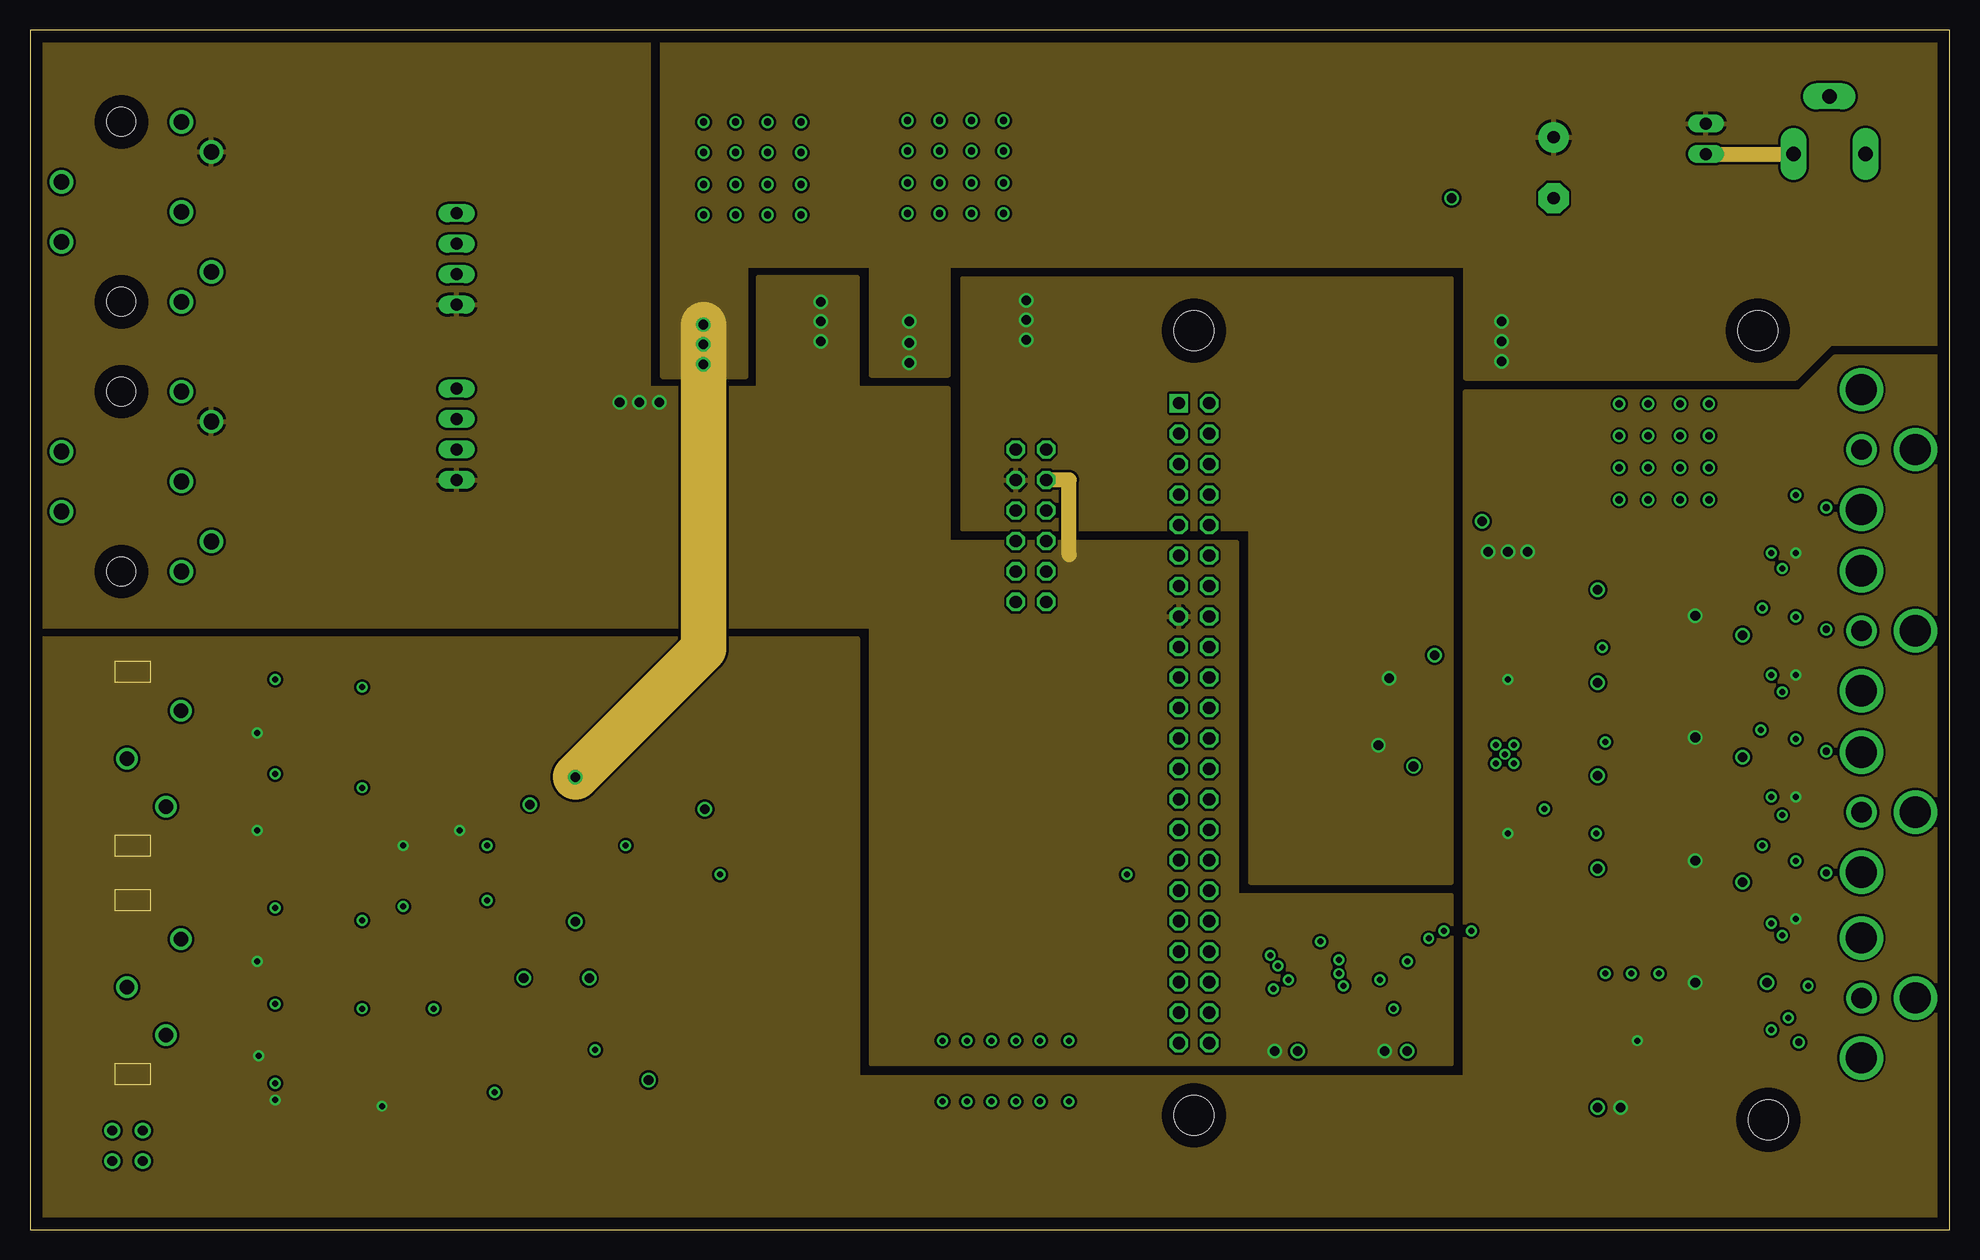
[diagram p6: board, inner layer Route3]
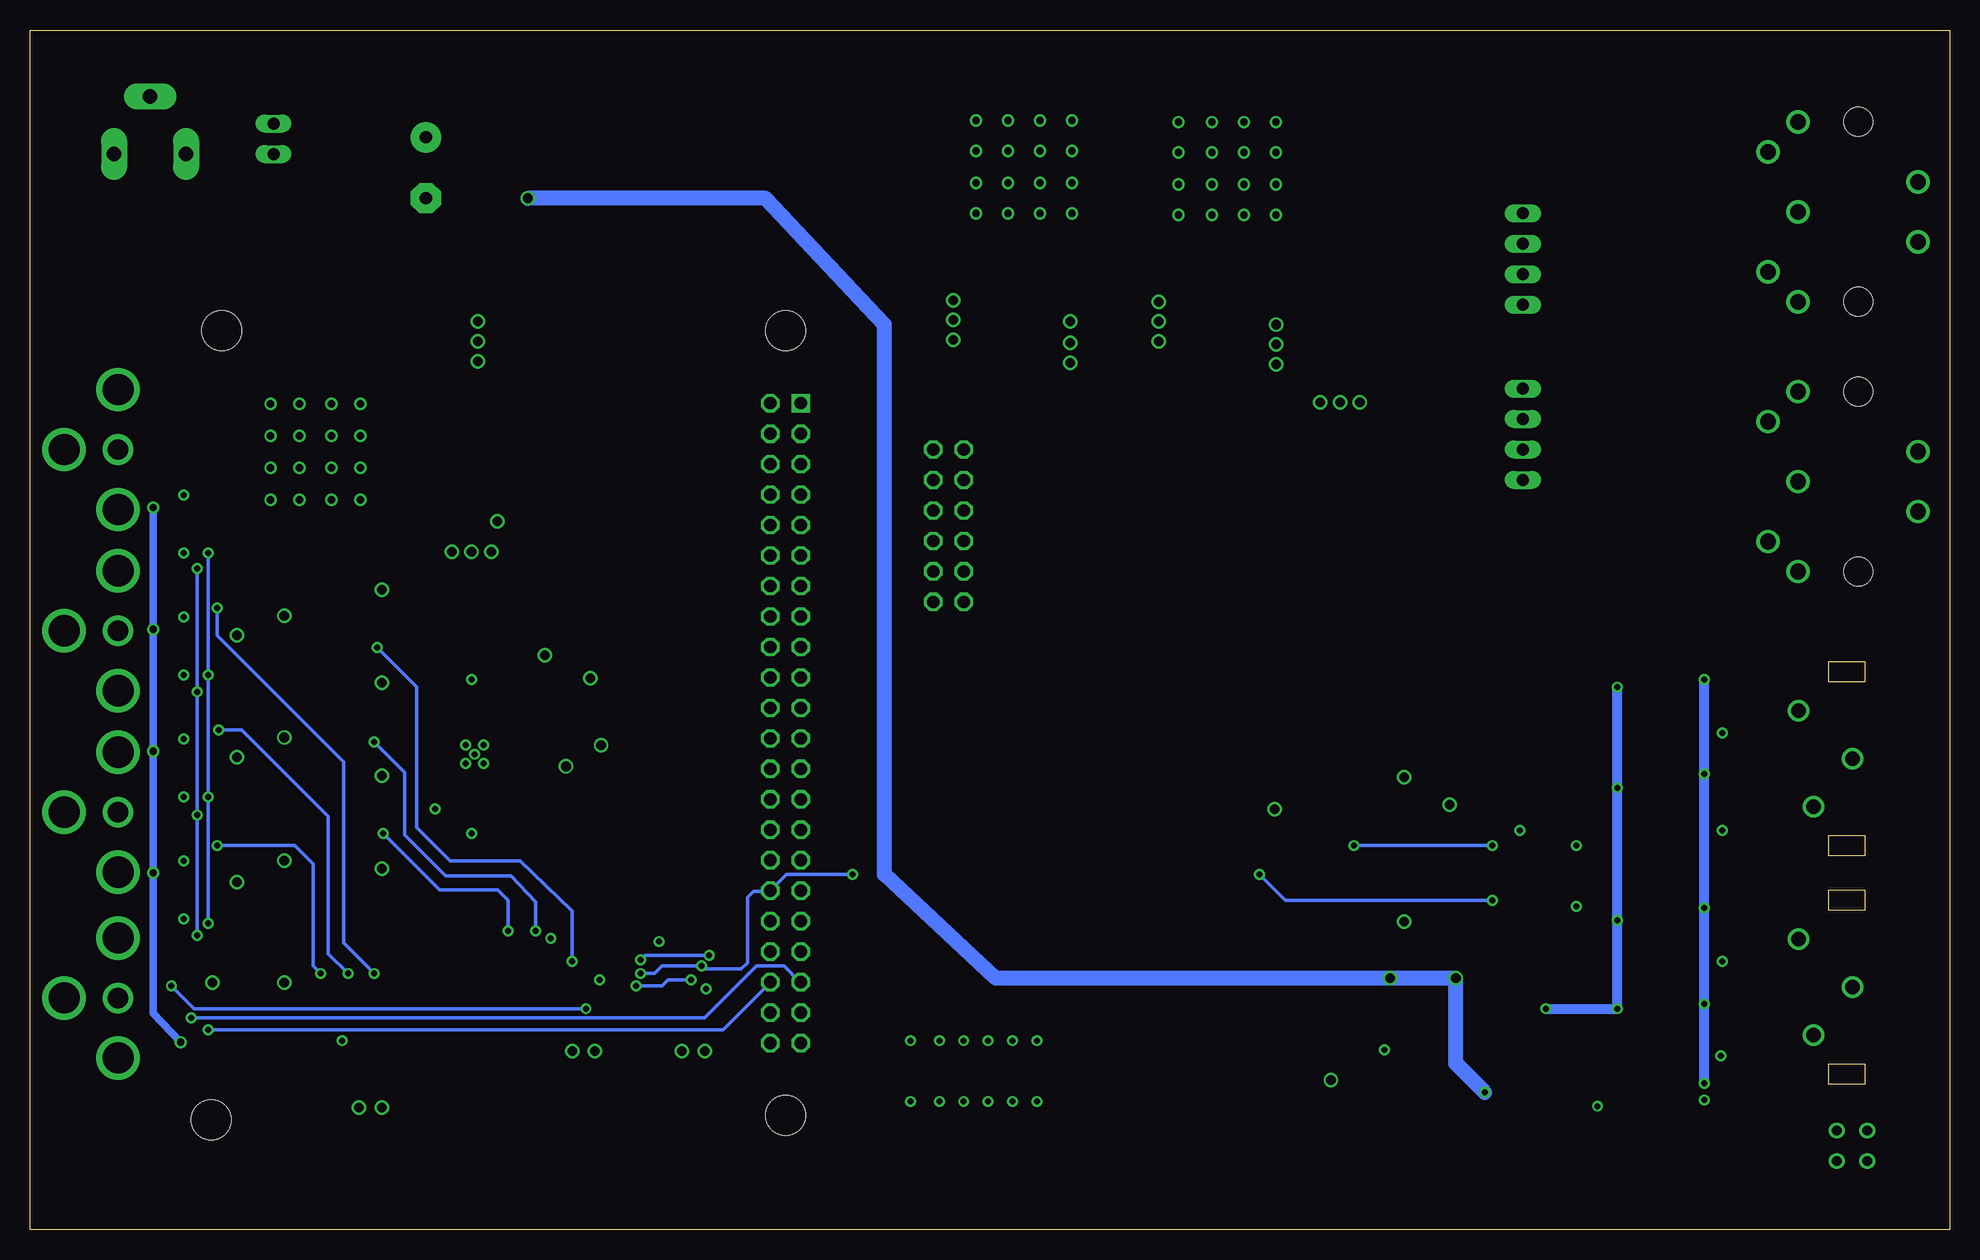
[diagram p7: board, bottom side, seen from below]

Size 160 x 100 mm. Coordinates in mm from the lower left corner, seen from the top.
Outline: 0,0 160,0 160,100 0,100 0,0
Copper layers (1*2+3*16): Top 0.035mm / dielectric 1.5mm / Route2 0.035mm / dielectric 0.15mm / Route3 0.035mm / dielectric 0.2mm / Bottom 0.035mm
Design rules "default *": minimum track width 10mil, minimum drill 24mil, track to track 8mil, track to pad 8mil, pad to pad 8mil, via to via 8mil, smd to smd 8mil, copper to edge 40mil, drill to drill 8mil, minimum pad ring 10mil, minimum via ring 8mil, stop-mask expansion 4mil, vias tented up to drill 0mil, thermal gap 10mil
Holes 3.3 mm at 97.03,74.93 97.03,9.53 144.02,74.93 144.91,9.14
tKeepout: area 93.9,71.8 to 100.2,78.1; area 93.9,6.4 to 100.2,12.7; area 140.8,71.8 to 147.2,78.1; area 141.7,6 to 148.1,12.3

### Footprints (pad centres in the part's own frame; a part is rotated, then mirrored left to right if it is on the bottom)
E5-13 = drill 1.016 pad 2.54 round: + -2.54,0 | drill 1.016 pad 2.54 octagon: - 2.54,0
C0805 = smd 1.3 x 1.5: 1 -0.95,0; 2 0.95,0
C1206 = smd 1.6 x 1.8: 1 -1.4,0; 2 1.4,0
2X06 = drill 1.016 octagon: 1 -6.35,-1.27; 2 -6.35,1.27; 3 -3.81,-1.27; 4 -3.81,1.27; 5 -1.27,-1.27; 6 -1.27,1.27; 7 1.27,-1.27; 8 1.27,1.27; 9 3.81,-1.27; 10 3.81,1.27; 11 6.35,-1.27; 12 6.35,1.27
22-23-2041 = drill 1 long: 1 -3.81,0; 2 -1.27,0; 3 1.27,0; 4 3.81,0
SDS-50J = drill 1.3 round: 1 7.5,5; 2 0,5; 3 -7.5,5; 4 5,7.5; 5 -5,7.5; SH1 -2.5,-5; SH2 2.5,-5 | hole 2.4: -7.5,0; 7.5,0
2X22@1 = drill 1.016 square: 1 0,0 | drill 1.016 octagon: 2 0,2.54; 3 2.54,0; 4 2.54,2.54; 5 5.08,0; 6 5.08,2.54; 7 7.62,0; 8 7.62,2.54; 9 10.16,0; 10 10.16,2.54; 11 12.7,0; 12 12.7,2.54; 13 15.24,0; 14 15.24,2.54; 15 17.78,0; 16 17.78,2.54; 17 20.32,0; 18 20.32,2.54; 19 22.86,0; 20 22.86,2.54; 21 25.4,0; 22 25.4,2.54; 23 27.94,0; 24 27.94,2.54; 25 30.48,0; 26 30.48,2.54; 27 33.02,0; 28 33.02,2.54; 29 35.56,0; 30 35.56,2.54; 31 38.1,0; 32 38.1,2.54; 33 40.64,0; 34 40.64,2.54; 35 43.18,0; 36 43.18,2.54; 37 45.72,0; 38 45.72,2.54; 39 48.26,0; 40 48.26,2.54; 41 50.8,0; 42 50.8,2.54; 43 53.34,0; 44 53.34,2.54
RCJ-01X = drill 2.6 round: 1@1 -5,0; 1@2 5,0; 1@3 0,4.5 | drill 1.7 round: 2 0,0
SPC4078 = drill 1.2 pad 2.184 long: 1 -3,0; 2 0,-4.8; 3 3,0
0603 = smd 0.85 x 0.7: 1 -0.9,0; 2 0.7,0
L1008 = smd 1.27 x 2.54: 1 -1.135,0; 2 1.135,0
LXHM250IGIGW = drill 0.8 round: AG1 -1.27,0; AG2 -1.27,-2.54; AR1 1.27,0; AR2 1.27,-2.54
L1812 = smd 1.9 x 3.4: 1 -1.95,0; 2 1.95,0
M0805 = smd 1.3 x 1.6: 1 -0.95,0; 2 0.95,0
RCJ-22XX = drill 1.2 round: 1 0,4.5; 2 -4,1.25; 3 4,0
22-23-2021 = drill 1 long: 1 -1.27,0; 2 1.27,0
R0805 = smd 1.3 x 1.5: 1 -0.95,0; 2 0.95,0
TO263-5 = smd 1.067 x 2.159: 1 -3.404,-5.791; 2 -1.702,-5.791; 3 0,-5.791; 4 1.702,-5.791; 5 3.404,-5.791 | smd 10.8 x 10.41: 6 0,2.54
UMAX10 = smd 0.32 x 0.9: 1 -1,-2.25; 2 -0.5,-2.25; 3 0,-2.25; 4 0.5,-2.25; 5 1,-2.25; 6 1,2.25; 7 0.5,2.25; 8 0,2.25; 9 -0.5,2.25; 10 -1,2.25
QFN-32 = smd 0.285 x 0.8: P$1 -1.75,-2.5; P$2 -1.25,-2.5; P$3 -0.75,-2.5; P$4 -0.25,-2.5; P$5 0.25,-2.5; P$6 0.75,-2.5; P$7 1.25,-2.5; P$8 1.75,-2.5; P$17 1.75,2.5; P$18 1.25,2.5; P$19 0.75,2.5; P$20 0.25,2.5; P$21 -0.25,2.5; P$22 -0.75,2.5; P$23 -1.25,2.5; P$24 -1.75,2.5 | smd 0.8 x 0.285: P$9 2.5,-1.75; P$10 2.5,-1.25; P$11 2.5,-0.75; P$12 2.5,-0.25; P$13 2.5,0.25; P$14 2.5,0.75; P$15 2.5,1.25; P$16 2.5,1.75; P$25 -2.5,1.75; P$26 -2.5,1.25; P$27 -2.5,0.75; P$28 -2.5,0.25; P$29 -2.5,-0.25; P$30 -2.5,-0.75; P$31 -2.5,-1.25; P$32 -2.5,-1.75 | smd 2.5 x 2.5: P$33 0,0
UMAX8 = smd 0.45 x 1.2: 1 -0.975,-2.175; 2 -0.325,-2.175; 3 0.325,-2.175; 4 0.975,-2.175; 5 0.975,2.175; 6 0.325,2.175; 7 -0.325,2.175; 8 -0.975,2.175
SSOP16 = smd 0.419 x 1.143: 1 -2.223,-2.6; 2 -1.587,-2.6; 3 -0.953,-2.6; 4 -0.318,-2.6; 5 0.318,-2.6; 6 0.953,-2.6; 7 1.587,-2.6; 8 2.223,-2.6; 9 2.223,2.6; 10 1.587,2.6; 11 0.953,2.6; 12 0.318,2.6; 13 -0.318,2.6; 14 -0.953,2.6; 15 -1.587,2.6; 16 -2.223,2.6
SSOP16' = smd 0.4 x 1.2: 1 -2.275,-2.925; 2 -1.625,-2.925; 3 -0.975,-2.925; 4 -0.325,-2.925; 5 0.325,-2.925; 6 0.975,-2.925; 7 1.625,-2.925; 8 2.275,-2.925; 9 2.275,2.925; 10 1.625,2.925; 11 0.975,2.925; 12 0.325,2.925; 13 -0.325,2.925; 14 -0.975,2.925; 15 -1.625,2.925; 16 -2.275,2.925
DBV_R-PDSO-G6 = smd 0.69 x 0.99: 1 -0.95,-1.29; 2 0,-1.29; 3 0.95,-1.29; 4 0.95,1.3; 5 0,1.3; 6 -0.95,1.3
SOT23-5 = smd 0.6 x 1.2: 1 -0.95,-1.306; 2 0,-1.306; 3 0.95,-1.306; 4 0.95,1.306; 5 -0.95,1.306
SOT23-DBV = smd 0.55 x 1.2: 1 -0.95,-1.3; 2 0,-1.3; 3 0.95,-1.3; 4 0.95,1.3; 5 -0.95,1.3
TSSOP8 = smd 1.2 x 0.35: 1 -2.925,0.975; 2 -2.925,0.325; 3 -2.925,-0.325; 4 -2.925,-0.975; 5 2.925,-0.975; 6 2.925,-0.325; 7 2.925,0.325; 8 2.925,0.975
ASE = smd 0.9 x 0.65: 1 -1.05,-0.825; 2 1.05,-0.825; 3 1.05,0.825; 4 -1.05,0.825

### Placement (x,y rotation side)
C1  127,88.52 270 top
C2  118.49,90.17 270 top
C3  75.56,76.07 270 top
C4  80.64,76.07 270 top
C5  123.44,66.55 180 top
C6  123.44,61.47 180 top
C7  58.55,75.95 270 top
C8  63.5,75.95 270 top
C9  45.47,29.46 270 top
C10  132.59,29.08 90 top
C11  132.59,36.83 90 top
C12  132.59,44.58 90 top
C13  132.59,52.32 90 top
C14  115.32,40.39 0 top
C15  121.67,44.83 270 top
C16  124.71,44.83 270 top
C17  124.71,34.04 90 top
C18  121.67,34.04 90 top
C19  43.18,29.46 270 top
C20  40.26,25.65 0 top
C21  40.01,34.54 90 top
C22  31.11,29.46 270 top
C23  141.73,53.34 0 top
C24  141.73,51.18 0 top
C25  141.73,43.18 0 top
C26  141.73,41.02 0 top
C27  141.73,32.89 0 top
C28  141.73,30.73 0 top
C29  141.73,22.73 0 top
C30  141.73,20.57 0 top
C31  116.2,45.97 0 top
C32  135.76,12.32 180 top
C33  130.68,15.37 270 top
C34  131.7,12.32 180 top
C35  113.79,16.51 0 top
C36  104.65,16.51 0 top
C38  42.55,14.1 270 top
C39  37.21,18.41 180 top
C40  42.55,18.41 0 top
DIO  83.44,58.67 90 top
ENC-A  35.56,80.9 90 top
ENC-B  35.56,66.29 90 top
ENC_C  7.62,62.36 270 top
ENC_D  7.62,84.84 270 top
FPGA  [2X22@1]  95.76,68.88 270 top
INA  152.65,19.3 270 top
INB  152.65,34.8 270 top
INC  152.65,49.91 270 top
IND  152.65,65.02 270 top
J1  149.99,89.66 180 top
L1  86.61,13.21 270 top
L2  122.68,70.23 90 top
L3  [L1008]  45.47,34.29 90 top
LED1  6.86,6.99 90 top
NP1  84.2,13.21 270 top
NP2  82.17,13.21 270 top
NP3  80.14,13.21 270 top
NP4  78.11,13.21 270 top
NP5  76.07,13.21 270 top
NP6  54.36,37.72 180 top
NP7  49.02,37.72 180 top
NP8  51.56,16.51 90 top
NP9  47.5,18.41 0 top
OUTAB  12.57,20.19 90 top
OUTCD  12.57,39.24 90 top
PSW  139.7,90.93 90 top
R1  123.95,59.05 0 top
R2  45.09,14.1 90 top
R3  124.97,69.72 270 top
R4  55.24,77.47 0 top
R5  72.26,77.6 0 top
R6  107.7,10.29 90 top
R7  110.74,10.29 90 top
R8  26.42,10.29 0 top
R9  26.42,8.13 180 top
R10  23.37,21.84 180 top
R11  17.91,25.15 270 top
R12  23.37,13.84 180 top
R13  17.91,17.14 270 top
R14  23.37,40.89 180 top
R15  17.91,44.2 270 top
R16  23.37,32.89 180 top
R17  17.91,36.2 270 top
R18  134.49,29.08 270 top
R19  134.62,36.83 270 top
R20  134.49,44.58 270 top
R21  134.62,52.32 270 top
U1  77.22,86.23 0 top
U2  133.73,64.9 270 top
U3  60.2,86.11 0 top
U4  141.73,26.04 90 top
U5  141.73,36.2 90 top
U6  141.73,46.35 90 top
U7  141.73,56.52 90 top
U8  122.94,39.62 90 top
U9  40.26,29.46 0 top
U10  34.8,29.46 0 top
U11  134.62,15.37 270 top
U12  74HC595DB  [SSOP16']  113.79,20.7 90 top
U13  74HC595DB  [SSOP16']  104.65,20.7 90 top
U14  147.19,28.32 180 top
U15  147.19,38.48 180 top
U16  147.19,48.64 180 top
U17  147.19,58.8 180 top
U18  39.62,14.1 180 top
U19  22.48,9.4 0 top
U20  23.37,24.51 180 top
U21  23.37,16.51 180 top
U22  23.37,43.56 180 top
U23  23.37,35.56 180 top
XTAL  116.33,43.56 0 top

### Tracks (layer width: path | path; a pad name or v marks a point on that pad's centre or on a via)
+3V3  (via drill 0.8)
  Top 0.305: U8.P$18 118.38,40.87 117.6,41.66 114.68,41.66 114.43,41.4 114.43,40.45 C14.1 | XTAL.4 115.28,45.95 C31.1
  Top 0.813: 80.62,77.53 C4.1 80.26,77.47 80.26,76.96 80.62,76.96 U1.5 U1.4
  Top 1.27: C31.1 v113.28,45.97 | v112.39,40.39 C14.1 | C4.1 82.8,77.47 v83.06,77.47 v83.06,75.82 v83.06,74.17
  pour Route3: 118.49,79.25 77.72,79.25 77.72,58.42 101.73,58.42 101.73,28.96 118.49,28.96
+5V/1  (via drill 0.5, 0.8)
  Top 0.305: 122.17,37.11 U8.P$27 122.19,36.33 122.17,36.32 123.19,36.32 | U8.P$29 123.19,36.32 | U8.P$12 | U8.P$14 122.19,41.52 122.3,41.4 123.06,41.4 123.19,41.53 U8.P$12 | U8.P$12 123.19,42.92 123.19,43.43 v123.19,45.85 | U10.11 35.81,32.13 v35.81,33.27 | 123.19,36.32 123.19,33.28 v123.19,33.02 | v123.19,33.02 121.73,33.02 C18.1 | v123.19,33.02 124.65,33.02 C17.1 | v123.19,45.85 124.65,45.85 C16.1 | v123.19,45.85 121.73,45.85 C15.1 | U5.9 140.33,35.7 140.72,35.31 140.72,32.96 C27.1 | U6.9 140.33,45.85 140.72,45.47 140.72,43.25 C25.1 | U4.9 140.45,25.54 140.84,25.15 140.84,22.79 C29.1 | U7.9 140.33,56.02 140.72,55.63 140.72,53.41 C23.1 | U11.2 132.44,15.75 v133.99,15.75 | U17.5 v147.19,56.39 | U16.5 v147.19,46.23 | U15.5 v147.19,36.07 | U14.5 v147.19,25.91 | U19.5 20.8,10.7 v20.45,10.79 | U21.8 20.11,15.54 v19.05,14.48 | U20.8 20.11,23.54 v18.92,22.35 | U23.8 20.23,34.59 v18.92,33.27 | U22.8 20.11,42.59 v18.92,41.4
  Top 0.406: v31.11,32 32.52,32 U10.16
  Top 0.61: R8.2 v29.34,10.29
  Top 0.813: 125,61.49 C6.1 127.94,61.47 U2.5 U2.4 | C22.1 v31.11,32
  Top 1.27: C23.1 C24.1 v138.81,51.18 | C25.1 C26.1 v138.81,41.02 | C29.1 C30.1 v138.81,20.57 | C27.1 C28.1 v138.81,30.73 | C34.1 132.65,10.16 v132.59,10.16 | v124.84,56.52 v123.19,56.52 v121.54,56.52 | v124.84,56.52 124.78,56.45 | C6.1 124.9,61.41 R1.2 124.9,56.58 v124.84,56.52
  pour Route3: 160.02,0 0,0 0,49.28 68.96,49.28 68.96,12.7 119.63,12.7 119.63,69.85 147.57,69.85 150.5,72.77 160.02,72.77
+5V/2  (via drill 0.8)
  Top 0.305: U13.16 101.72,17.15 102.36,16.51 C36.1 | U12.16 110.87,17.15 111.51,16.51 C35.1
  Top 0.813: 63.6,77.45 C8.1 63.6,77.35 U3.5 U3.4
  Top 1.27: C36.1 103.7,14.92 v103.76,14.86 | C35.1 112.84,14.92 v112.9,14.86 | C8.1 v65.91,77.34 v65.91,75.69 v65.91,74.04 65.91,70.99 63.88,68.96 v52.45,68.96 v50.8,68.96 v49.15,68.96
  Route3 1.27: FPGA.15 95.76,51.18 | DIO.9 86.61,62.48 86.61,56.26
  pour Route3: 70.1,50.29 70.1,13.84 118.49,13.84 118.49,27.81 100.58,27.81 100.58,57.28 76.58,57.28 76.58,70.1 68.96,70.1 68.96,79.38 60.71,79.38 60.71,70.1 51.56,70.1 51.56,100.08 0,99.95 0,50.29
+6V
  Top 0.305: C19.1 43.11,30.48 42.04,30.48 39.93,28.38 U9.2
  Top 1.27: L3.1 C9.1 45.02,30.41 C19.1
-5V  (via drill 0.5)
  Top 0.305: U22.4 27.01,44.54 v27.69,45.21 | U23.4 27.39,36.53 v27.69,36.83 | U20.4 27.39,25.49 v27.69,25.78 | U21.4 26.76,17.48 v27.69,18.41 | U19.2 22.48,7.11 22.99,6.6 26.92,6.6 27.3,6.99 27.3,8.07 R9.1
  Top 0.61: R2.1 42.99,13.15 C38.2 42.45,12.79 U18.5 40.57,13.15 39.62,14.1 35.81,14.1 | C39.2 35.81,14.1 | 35.81,14.1 35.81,11.94 32,8.13 R9.1
  Top 0.813: C39.2 v33.66,18.41
  Bottom 0.813: v27.69,45.21 v27.69,36.83 v27.69,25.78 v27.69,18.41 v33.66,18.41
AGND  (via drill 0.5, 0.6, 0.8)
  Top 0.305: U8.P$30 123.69,36.01 C17.2 124.71,35.05 v126.24,35.05 | v122.17,38.86 121.69,38.37 U8.P$26 121.69,35.26 C18.2 | v122.17,40.39 121.69,40.87 U8.P$15 121.67,42.14 C15.2 | v123.7,40.39 123.69,40.4 U8.P$11 123.69,42.85 C16.2 | NP1.2 v84.2,10.67 | NP2.2 v82.17,10.67 | NP3.2 v80.14,10.67 | NP4.2 v78.11,10.67 | NP5.2 v76.07,10.67 | L1.2 v86.61,10.67 | C19.2 41.95,27.29 U9.4 | U9.3 U9.4 | C20.2 41.21,27.29 U9.4 | U11.4 130.71,14.39 C33.2 130.75,14.35 | U11.4 U11.3 | U11.4 133.94,14.39 134.75,13.59 134.75,12.38 C32.2 | U7.4 U7.3 143.38,56.52 142.62,55.75 142.62,53.4 C23.2 | C27.2 142.75,32.96 142.75,35.56 143.38,36.2 U5.3 U5.4 | U6.4 U6.3 143.26,46.35 142.68,45.78 C25.2 | U4.4 U4.3 143.26,26.04 142.68,25.46 C29.2 | U17.2 v147.19,61.21 | U14.2 v147.19,30.73 | U15.2 v147.19,40.89 | U16.2 v147.19,51.05
  Top 0.406: v31.11,26.92 32.52,26.92 U10.1 U10.2
  Top 0.61: U18.1 42.45,15.4 C38.1 | R2.2 42.99,15.05 C38.1 | C40.2 43.95,16.9 C38.1
  Top 0.813: 135.89,64.64 v137.54,66.17 136.27,64.77 U2.6 U2.3 127.94,64.77 122.04,64.77 | C6.2 122.04,64.77 | 122.04,64.77 C5.2 | v142.75,28.96 142.68,28.96 | 144.71,20.57 v144.78,20.57 | C13.2 132.59,53.34 v130.68,53.34 | C12.2 132.59,45.59 v130.68,45.59 | C11.2 132.59,37.85 v130.68,37.85 | 132.59,30.1 C10.2 | v31.11,26.92 C22.2 | v47.12,14.99 45.15,14.99 R2.2
  Top 1.27: C19.2 45.02,28.51 C9.2 v45.47,25.65 | C21.2 40.01,35.43 v41.66,35.43 | C23.2 C24.2 142.68,49.6 v142.75,49.53 | C25.2 C26.2 142.68,39.44 v142.75,39.37 | C29.2 C30.2 144.71,20.57 | C27.2 C28.2 142.68,28.96 | v130.68,30.1 132.59,30.1 | v121.03,59.05 R1.1 | C34.2 130.68,12.32 | 130.68,12.32 v130.68,10.16 | 130.68,12.32 C33.2 | v56.26,35.05 NP6.1 | v51.56,12.45 NP8.1
  other vias: 123.7,38.86 122.94,39.62 132.46,60.83 132.46,63.5 132.46,66.17 134.87,63.5 134.87,60.83 134.87,68.83 137.54,68.83 139.95,66.17 139.95,68.83 137.54,63.5 137.54,60.83 139.95,60.83 139.95,63.5 132.46,68.83 134.87,66.17
  pour Route2: 160.02,0 0,0 0,49.28 68.96,49.28 68.96,12.7 119.63,12.7 119.63,69.85 147.57,69.85 150.5,72.77 160.02,72.77
CAL0  (via drill 0.5)
  Top 0.305: U12.15 113,19.08 v113.67,18.41 | v148.21,20.32 148.21,26.95 U14.6
  Bottom 0.305: v113.67,18.41 146.3,18.41 v148.21,20.32
CAL1  (via drill 0.5)
  Top 0.305: U15.6 148.14,35.11 145.16,32 v144.4,32 | v135.76,21.34 132.85,18.43 U12.1
  Bottom 0.305: v144.4,32 137.92,32 136.4,30.48 136.4,21.97 v135.76,21.34
CAL2  (via drill 0.5)
  Top 0.305: U16.6 148.14,45.53 v144.27,41.66 | v133.48,21.34 131.22,19.08 U12.2
  Bottom 0.305: v144.27,41.66 142.37,41.66 135.13,34.42 135.13,22.99 v133.48,21.34
CAL3  (via drill 0.5)
  Top 0.305: U17.6 148.14,55.56 v144.4,51.82 | v131.32,21.34 129.71,19.73 U12.3
  Bottom 0.305: v144.4,51.82 144.4,49.53 133.86,38.99 133.86,23.88 v131.32,21.34
CS0
  Top 0.305: U12.4 120.2,20.38 124.84,25.02 139.47,25.02 U4.10
CS1  (via drill 0.5)
  Top 0.305: U12.5 119.45,21.03 120.14,21.72 v120.14,24.89 | U5.10 137.68,35.2 135.51,33.02 v130.56,33.02
  Bottom 0.305: v120.14,24.89 120.14,27.43 121.03,28.32 125.86,28.32 v130.56,33.02
CS2  (via drill 0.5)
  Top 0.305: U12.6 117.31,21.68 117.86,22.23 v117.86,24.89 | U6.10 139.48,44.61 135.51,40.64 v131.32,40.64
  Bottom 0.305: v131.32,40.64 128.78,38.1 128.78,32.89 125.35,29.46 119.89,29.46 117.86,27.3 v117.86,24.89
CS3  (via drill 0.5)
  Top 0.305: U7.10 138.06,55.52 137.16,54.61 137.16,49.66 136.02,48.51 v131.06,48.51 | U12.7 114.83,22.33 v114.81,22.35
  Bottom 0.305: v114.81,22.35 114.81,26.54 119.13,30.73 124.97,30.73 127.76,33.53 127.76,45.21 v131.06,48.51
DGND  (via drill 0.5, 0.6, 0.8)
  Top 0.305: NP5.1 v76.07,15.75 | NP4.1 v78.11,15.75 | NP3.1 v80.14,15.75 | NP2.1 v82.17,15.75 | U8.P$16 121.19,40.54 121.03,40.39 120.45,40.39 | 120.45,40.39 U8.P$19 | C14.2 120.45,40.39 | XTAL.2 117.16,42.74 116.33,43.56 116.33,45.15 C31.2 | NP1.1 v84.2,15.75 | L1.1 v86.61,15.75 | U13.8 v107.57,24 | U13.13 103.32,20.38 v103.63,20.07 | U12.13 112.08,20.38 v112.52,20.83 | U12.8 116.59,22.98 v116.59,24.26
  Top 0.406: 77.22,87.25 v75.82,87.25 | 77.22,80.39 U1.3 77.22,87.25 | 77.22,87.25 U1.6
  Top 0.813: U1.3 U1.6 | v61.47,89.79 61.34,89.79 U3.6 U3.3 60.2,74.55 | 77.34,74.67 C4.2 | C3.2 77.34,74.67 | 77.22,80.39 77.22,74.8 77.34,74.67 | C7.2 60.2,74.55 | C14.2 116.27,39.56 v115.32,38.61 | C31.2 117.16,47.75 v117.09,47.88 | 60.2,74.55 C8.2
  Top 1.27: C36.2 105.6,14.93 v105.66,14.86 | C35.2 114.74,14.93 v114.81,14.86
  other vias: 73.15,84.71 73.15,87.25 73.15,89.92 73.15,92.46 75.82,92.46 75.82,89.92 75.82,84.71 78.49,84.71 78.49,87.25 78.49,89.92 78.49,92.46 81.15,92.46 81.15,89.92 81.15,87.25 81.15,84.71 56.13,84.58 56.13,87.12 56.13,89.79 56.13,92.33 58.8,84.58 61.47,84.58 64.26,84.58 58.8,87.12 58.8,89.79 58.8,92.33 61.47,87.12 64.26,87.12 61.47,92.33 64.26,89.79 64.26,92.33
  pour Route2: 160.02,73.91 150.11,73.91 147.19,70.99 118.49,70.99 118.49,13.84 70.1,13.84 70.1,50.29 0,50.29 0,99.95 160.02,99.95
DIO6
  Top 0.305: FPGA.6 97.1,62.61 93.22,62.61 91.82,61.21 83.44,61.21 DIO.8
DIO8
  Top 0.305: FPGA.8 98.3,61.21 97.03,59.94 DIO.7
DIO11
  Top 0.305: FPGA.11 83.39,56.19 DIO.6
DIO12
  Top 0.305: FPGA.12 98.3,56.26 97.16,57.4 DIO.5
DIO13
  Top 0.305: FPGA.13 83.39,53.65 DIO.4
DIO14
  Top 0.305: DIO.3 97.08,54.86 FPGA.14
DIO19
  Top 0.305: FPGA.19 88.47,46.02 DIO.2
DIO20
  Top 0.305: FPGA.20 98.25,46.02 97.03,47.24 89.79,47.24 DIO.1
DIO21
  Top 0.305: ENC-A.2 38.61,79.63 44.32,73.91 44.32,62.1 45.21,61.21 66.67,61.21 78.23,49.66 78.23,44.2 78.94,43.48 FPGA.21 95.71,43.43
DIO22
  Top 0.305: FPGA.22 98.25,43.48 97.03,44.7 80.01,44.7 79.38,45.34 79.38,49.4 66.8,61.98 45.97,61.98 45.09,62.87 45.09,74.04 36.96,82.17 ENC-A.3
DIO23
  Top 0.305: ENC-B.2 38.73,65.02 44.07,59.69 66.42,59.69 76.2,49.91 76.2,42.16 77.42,40.95 FPGA.23
DIO24
  Top 0.305: ENC-B.3 37.08,67.56 44.2,60.45 66.55,60.45 77.22,49.78 77.22,43.18 78.23,42.16 97.16,42.16 98.3,41.02 FPGA.24
DIO25
  Top 0.305: ENC_D.1 15.37,77.34 18.67,74.04 18.67,63.37 23.88,58.17 66.17,58.17 74.04,50.29 74.04,39.88 75.51,38.41 FPGA.25
DIO26
  Top 0.305: ENC_D.4 20.32,74.64 20.32,63.37 24.77,58.93 66.29,58.93 75.06,50.16 75.06,41.02 76.45,39.62 97.03,39.62 98.25,38.41 FPGA.26
DIO27
  Top 0.305: ENC_C.1 66.81,54.86 71.75,49.78 71.75,37.59 73.48,35.87 FPGA.27
DIO28
  Top 0.305: FPGA.28 98.3,35.94 97.03,37.21 74.68,37.21 73.03,38.86 73.03,50.42 66.09,57.36 ENC_C.4
DIO29
  Top 0.305: FPGA.29 95.76,33.53 96.9,34.67 113.03,34.67 118.24,39.88 U8.P$20
DIO30
  Top 0.305: U8.P$21 118.5,39.37 112.65,33.53 98.5,33.53 FPGA.30
DIO31
  Top 0.305: U8.P$22 118.76,38.87 112.01,32.13 97.1,32.13 FPGA.31
  Bottom 0.305: FPGA.31 95.76,30.73
DIO32
  Top 0.305: FPGA.32 111.43,30.79 119,38.35 120.42,38.35 U8.P$23
DIO33
  Top 0.305: U8.P$24 119.28,37.87 110.87,29.46 96.98,29.46 FPGA.33
  Bottom 0.305: FPGA.33 95.76,28.19
DIO34  (via drill 0.5)
  Top 0.305: U12.11 109.43,21.68 v109.09,21.34 | U13.11 103.72,21.68 v104.01,21.97 | U10.8 37.53,26.86 v38.1,27.43 | v57.53,29.59 83.06,29.59 v91.44,29.59
  Bottom 0.305: v109.09,21.34 107.95,21.34 107.31,21.97 v104.01,21.97 103.76,21.72 100.71,21.72 100.2,22.23 100.2,27.69 99.69,28.19 98.35,28.19 FPGA.34 96.95,29.59 v91.44,29.59 | v38.1,27.43 55.37,27.43 v57.53,29.59
DIO35
  Top 0.305: U10.7 36.39,24.57 37.34,23.62 47.75,23.62 49.84,25.7 FPGA.35
DIO36  (via drill 0.5)
  Top 0.305: FPGA.36 111.33,25.7 113.92,23.11 113.92,20.45 113.16,19.68 110.91,19.68 U12.14 | U10.9 38.04,32.06 v38.1,32 | FPGA.36 98.3,25.65 | FPGA.36 98.25,25.7 97.03,26.92 54.74,26.92 v49.66,32
  Bottom 0.305: v38.1,32 v49.66,32
DIO37  (via drill 0.5)
  Top 0.305: U12.10 109.25,22.33 v109.09,22.48 | v103.38,22.86 102.84,22.33 U13.10 100.74,22.33 100.2,22.86 100.2,23.88 99.69,24.38 96.98,24.38 FPGA.37
  Bottom 0.305: v109.09,22.48 108.71,22.86 v103.38,22.86
DIO38  (via drill 0.5)
  Top 0.305: U12.12 110.18,21.03 v109.47,20.32 | v104.9,20.83 104.7,21.03 U13.12 100.44,21.03 FPGA.38
  Bottom 0.305: v104.9,20.83 106.81,20.83 107.31,20.32 v109.47,20.32
DIO39  (via drill 0.5)
  Top 0.305: U7.2 144.79,56.02 v145.16,56.39 | U6.2 144.79,45.85 v145.16,46.23 | U5.2 144.79,35.7 v145.16,36.07 | v146.56,17.65 147.19,18.29 147.19,24.51 146.18,25.53 v145.16,25.53 v145.15,25.54 U4.2
  Bottom 0.305: v145.16,56.39 v145.16,46.23 v145.16,36.07 v145.16,25.53 | FPGA.39 95.81,20.62 97.16,21.97 99.44,21.97 103.76,17.65 v146.56,17.65
DIO40  (via drill 0.5)
  Top 0.305: U7.1 145.65,55.52 v146.05,55.12 | U6.1 145.53,45.35 v146.05,44.83 | U5.1 145.4,35.2 v146.05,34.54 | v145.16,16.64 145.16,18.54 146.05,19.43 v146.05,24.51 144.51,24.51 U4.1
  Bottom 0.305: v146.05,24.51 v146.05,34.54 v146.05,44.83 v146.05,55.12 | FPGA.40 98.3,20.57 102.23,16.64 v145.16,16.64
LED0
  Top 0.305: U13.15 100.86,19.08 100.46,18.67 100.46,17.02 101.73,15.75 101.73,7.11 100.08,5.46 16.51,5.46 11.05,10.92 7.75,10.92 6.86,10.03 LED1.AR1
LED1
  Top 0.305: R6.2 107.7,18.3 U13.1
LED2
  Top 0.305: U13.2 108.69,19.08 109.22,18.54 109.22,7.24 105.92,3.94 13.46,3.94 LED1.AR2
LED3
  Top 0.305: R7.2 110.74,14.1 109.86,14.99 109.86,18.67 108.8,19.73 U13.3
MCLK
  Top 0.305: U8.P$17 120.33,41.37 XTAL.3
N$1
  Top 0.305: U7.8 135.89,56.52 134.62,55.24 R21.1
N$2
  Top 0.305: U12.9 110.88,23.61 109.35,25.15 106.93,25.15 106.05,24.26 106.05,20.07 105.16,19.18 103.12,19.18 102.58,19.73 U13.14
N$3
  Top 0.305: R20.1 135.82,45.53 136.65,46.35 U6.8
N$4
  Top 0.305: U8.P$1 126.08,37.87 128.4,36.2 128.4,29.08 129.29,28.19 132.53,28.19 C10.1
  Top 0.813: C10.1 R18.2
N$5  (via drill 0.5, 0.8)
  Top 0.305: v38.73,11.43 38.73,12.73 U18.4
  Top 0.61: U18.2 39.62,16.89 C40.1
  Top 1.27: v118.49,85.98 C2.2 | C40.1 v41.15,20.95 | NP9.1 46.61,18.41 v46.61,20.95
  Route2 1.27: v118.49,85.98 C1.- 149.3,85.98 J1.1
  Bottom 0.813: J1.1 152.65,89.66
  Bottom 1.27: v118.49,85.98 98.68,85.98 88.77,75.44 88.77,29.59 79.5,20.95 v46.61,20.95 v41.15,20.95 41.15,13.84 v38.73,11.43
N$6
  Top 0.305: R19.1 135.57,37.78 137.16,36.2 U5.8
N$7
  Top 0.813: R3.1 127.32,70.67 127.89,70.1 127.89,68.35 U2.1
N$8
  Top 0.813: U2.2 124.84,66.6 C5.1 124.97,66.55 R3.2 | R3.2 124.97,68.71 | L2.1 122.68,68.83 122.81,68.83 124.92,68.82 R3.2
N$9
  Top 1.27: NP8.2 48.45,18.46 NP9.2
N$10
  Top 0.305: R18.1 135.45,30.03 136.78,28.7 136.78,27.3 138.05,26.04 U4.8
N$11
  Top 0.305: U19.3 25.44,8.1 R9.2
  Top 1.27: R9.2 R8.1
N$12
  Top 0.305: U11.1 130.71,16.34 C33.1
N$13
  Top 0.61: U18.3 38.67,18.35 C39.1
N$14
  Top 0.305: C11.1 131.12,35.88 128.14,38.86 U8.P$3
  Top 0.813: C11.1 R19.2
N$15
  Top 0.305: U4.5 146.23,27.04 U14.4
N$16  (via drill 0.5)
  Top 0.305: U21.5 v20.44,18.79 v20.45,18.8 | U20.5 v20.44,26.79 v20.45,26.8 | U23.5 v20.44,37.97 v20.45,37.97 | U22.5 v20.44,45.84 v20.45,45.85 | U19.1 21.53,9.08 21.84,9.4 23.11,9.4 23.43,9.71 U19.4 23.43,12 23.24,12.19 v20.45,12.19
  Bottom 0.813: v20.45,45.85 v20.45,37.97 v20.45,26.8 v20.45,18.8 v20.45,12.19
N$17
  Top 0.305: 146.15,37.47 U15.4 146.13,37.2 U5.5
N$18
  Top 0.305: U6.5 146.23,47.35 U16.4
N$19
  Top 0.61: INA.2 151.13,19.3 149.73,20.7 149.73,27.69 149.1,28.32 146.24,28.32 U14.3
N$20
  Top 0.305: C12.1 132.53,43.63 129.29,40.39 125.45,40.39 U8.P$6
  Top 0.813: C12.1 R20.2
N$21
  Top 0.305: C13.1 130.11,51.37 128.78,50.04 128.78,42.42 127.13,41.4 125.46,41.4 U8.P$8
  Top 0.813: C13.1 R21.2
N$22
  Top 0.61: INB.2 148.97,38.48 146.24,38.48 U15.3
N$23
  Top 0.61: INC.2 151.26,48.51 146.24,48.51 U16.3
N$24
  Top 0.61: U17.3 146.24,63.82 147.45,65.02 IND.2
N$25
  Top 0.305: U7.5 146.23,57.52 U17.4
N$26
  Top 0.305: C20.1 39.31,27.29 U9.1
N$27  (via drill 0.6)
  Top 0.305: 136.71,12.64 C32.1 137.67,12.32 137.76,12.42 137.76,15.62 | U11.6 137.12,15.37 137.76,15.62 | U11.6 U11.7 | U11.6 136.79,15.13 | 137.67,15.62 137.67,15.08 137.76,15.62
  Top 0.61: 137.67,15.62 137.76,15.62 v147.45,15.62 | v149.73,29.72 148.25,29.72 U14.1 | v149.73,39.88 148.16,39.88 U15.1 | v149.73,60.2 148.25,60.2 U17.1 | v149.73,50.04 148.25,50.04 U16.1
  Bottom 0.61: v149.73,60.2 v149.73,50.04 v149.73,39.88 v149.73,29.72 149.73,18.03 v147.45,15.62
N$28
  Top 0.305: R6.1 107.7,7.37 105.03,4.7 15.11,4.7 10.03,9.78 8.76,9.78 8.13,9.14 8.13,6.99 LED1.AG1
N$29
  Top 0.305: R10.1 25.15,21.84 26.29,22.99 U20.1 U20.2
N$30
  Top 0.305: 35.18,32 U10.12 35.12,31.3 35.69,30.73 35.69,29.46 | 33.78,29.46 35.69,29.46 | 33.78,29.46 33.27,29.97 33.27,32 U10.15 | 33.78,29.46 33.78,26.93 U10.3 | C21.1 39.94,33.59 39.94,31.64 | 35.69,29.46 39.5,29.46 39.93,29.9 U9.7 39.94,31.64 | U10.6 35.75,29.4 35.69,29.46 | 39.94,31.64 U9.6
N$31
  Top 0.813: U3.1 54.91,80.31 54.36,79.76 54.36,77.53 R4.1
N$32
  Top 0.305: U20.3 33.6,24.84 34.48,25.72 U10.4
N$33
  Top 0.305: U10.5 35.12,21.53 30.42,16.84 U21.3
N$34
  Top 0.305: U10.13 34.48,33.34 33.53,34.29 30.61,34.29 29.34,35.56 29.34,42.8 28.25,43.89 U22.3
N$35
  Top 0.305: U10.14 33.85,32.96 33.53,33.27 29.46,33.27 28.32,34.42 28.32,35.31 27.74,35.88 U23.3
N$36
  Top 0.305: R11.1 18.22,25.78 18.54,25.78 19.49,24.84 U20.6 21.9,24.84 22.35,24.38 22.35,21.91 R10.2
N$37
  Top 0.305: U20.7 17.92,24.19 R11.2 | OUTAB.3 R11.2
  Top 1.27: R11.2
N$38
  Top 0.305: LED1.AG2 11.94,3.17 106.68,3.17 110.74,7.24 R7.1
N$39
  Top 0.305: U21.7 17.92,16.18 R13.2 | OUTAB.2 R13.2
  Top 1.27: R13.2
N$40
  Top 0.305: R13.1 18.22,17.78 18.54,17.78 19.49,16.84 U21.6 22.03,16.84 22.35,16.51 22.35,13.91 R12.2
N$41
  Top 0.305: R15.1 18.09,44.96 18.41,44.96 19.49,43.89 U22.6 21.9,43.89 22.35,43.43 22.35,40.96 R14.2
N$42
  Top 0.305: U22.7 17.92,43.24 R15.2 | OUTCD.3 R15.2
  Top 1.27: R15.2
N$43
  Top 0.305: U23.7 R17.2 | OUTCD.2 R17.2
  Top 1.27: R17.2
N$44
  Top 0.305: R17.1 18.09,36.96 18.41,36.96 19.49,35.88 U23.6 21.9,35.88 22.35,35.43 22.35,32.96 R16.2
N$45
  Top 0.305: R12.1 25.15,13.84 26.29,14.99 U21.1 U21.2
N$46
  Top 0.305: R14.1 25.15,40.89 26.29,42.04 U22.1 U22.2
N$47
  Top 0.305: R16.1 25.27,32.89 26.29,33.91 U23.1 U23.2
N$48
  Top 1.27: NP7.1 NP6.2 52.45,37.72
N$49
  Route3 1.27: PSW.1 J1.3
N$50
  Top 0.305: U4.6 138.43,27.04 | 138.43,27.04 138.43,27.05 | U4.7 138.43,26.54 138.43,27.04
N$51
  Top 0.305: 138.43,37.2 U5.6 | 138.43,37.2 138.43,37.21 | U5.7 138.43,36.7 138.43,37.2
N$52
  Top 0.305: U6.7 138.43,46.85 138.43,46.86 138.43,47.35 U6.6
N$53
  Top 0.305: U7.7 138.56,57.02 138.56,57.52 U7.6
N$911
  Top 0.813: R5.1 71.31,79.95 71.75,80.39 73.76,80.39 U1.1
PWRIN  (via drill 0.8)
  Top 0.813: U1.2 75.51,77.53 C3.1 | U3.2 58.55,80.26 C7.1 58.42,77.47 | L2.2 v122.68,72.39 v122.68,74.04 v122.68,75.69
  Top 1.27: C1.+ 118.56,91.06 C2.1 | L3.2 v45.47,37.72 NP7.2 | 73.28,77.53 75.51,77.53 | v73.28,72.26 v73.28,73.91 v73.28,75.69 73.28,77.53 | v56.13,72.14 v56.13,73.79 v56.13,75.44 56.13,77.47 R4.2 58.42,77.47 | 73.28,77.53 R5.2
  Route3 3.81: v56.13,75.44 v56.13,73.79 v56.13,72.14 56.13,48.39 v45.47,37.72
  pour Route3: 52.7,99.95 52.7,71.12 59.69,71.12 59.69,80.39 70.1,80.39 70.1,71.25 76.58,71.25 76.58,80.39 119.63,80.39 119.63,70.99 147.19,70.99 150.11,73.91 160.02,73.91 160.02,99.95
VREF
  Top 0.305: 125.42,38.35 U8.P$2 124.69,38.37 124.65,38.42 | U8.P$10 U8.P$9 124.69,40.89 | U8.P$31 U8.P$32 | U8.P$31 124.21,37.12 | U8.P$28 122.69,37.97 122.68,37.97 124.21,37.97 | 124.21,37.14 124.21,37.97 | U8.P$31 124.21,37.14 | 124.21,37.14 124.21,37.08 | 124.69,39.88 124.69,40.89 | 124.69,39.37 124.69,39.88 | 124.69,39.37 124.69,38.45 124.65,38.42 | 124.21,37.97 124.65,38.42 | U8.P$4 124.69,39.37 | U8.P$5 124.69,39.87 124.69,39.88 | U8.P$7 124.71,40.87 124.69,40.89
(copper drawn outside any net)
  shapes: Top area x1

### Text on the board
tNames: Sigma Delta Daughterboard V2C | Dan Kouba/Alec Dibble | Brewer Research Group, 2012 | +D5V | +D3.3V | +A5V | U8 | -A5V